# EAGLE design test_eyes (EAGLE 9.6.0)
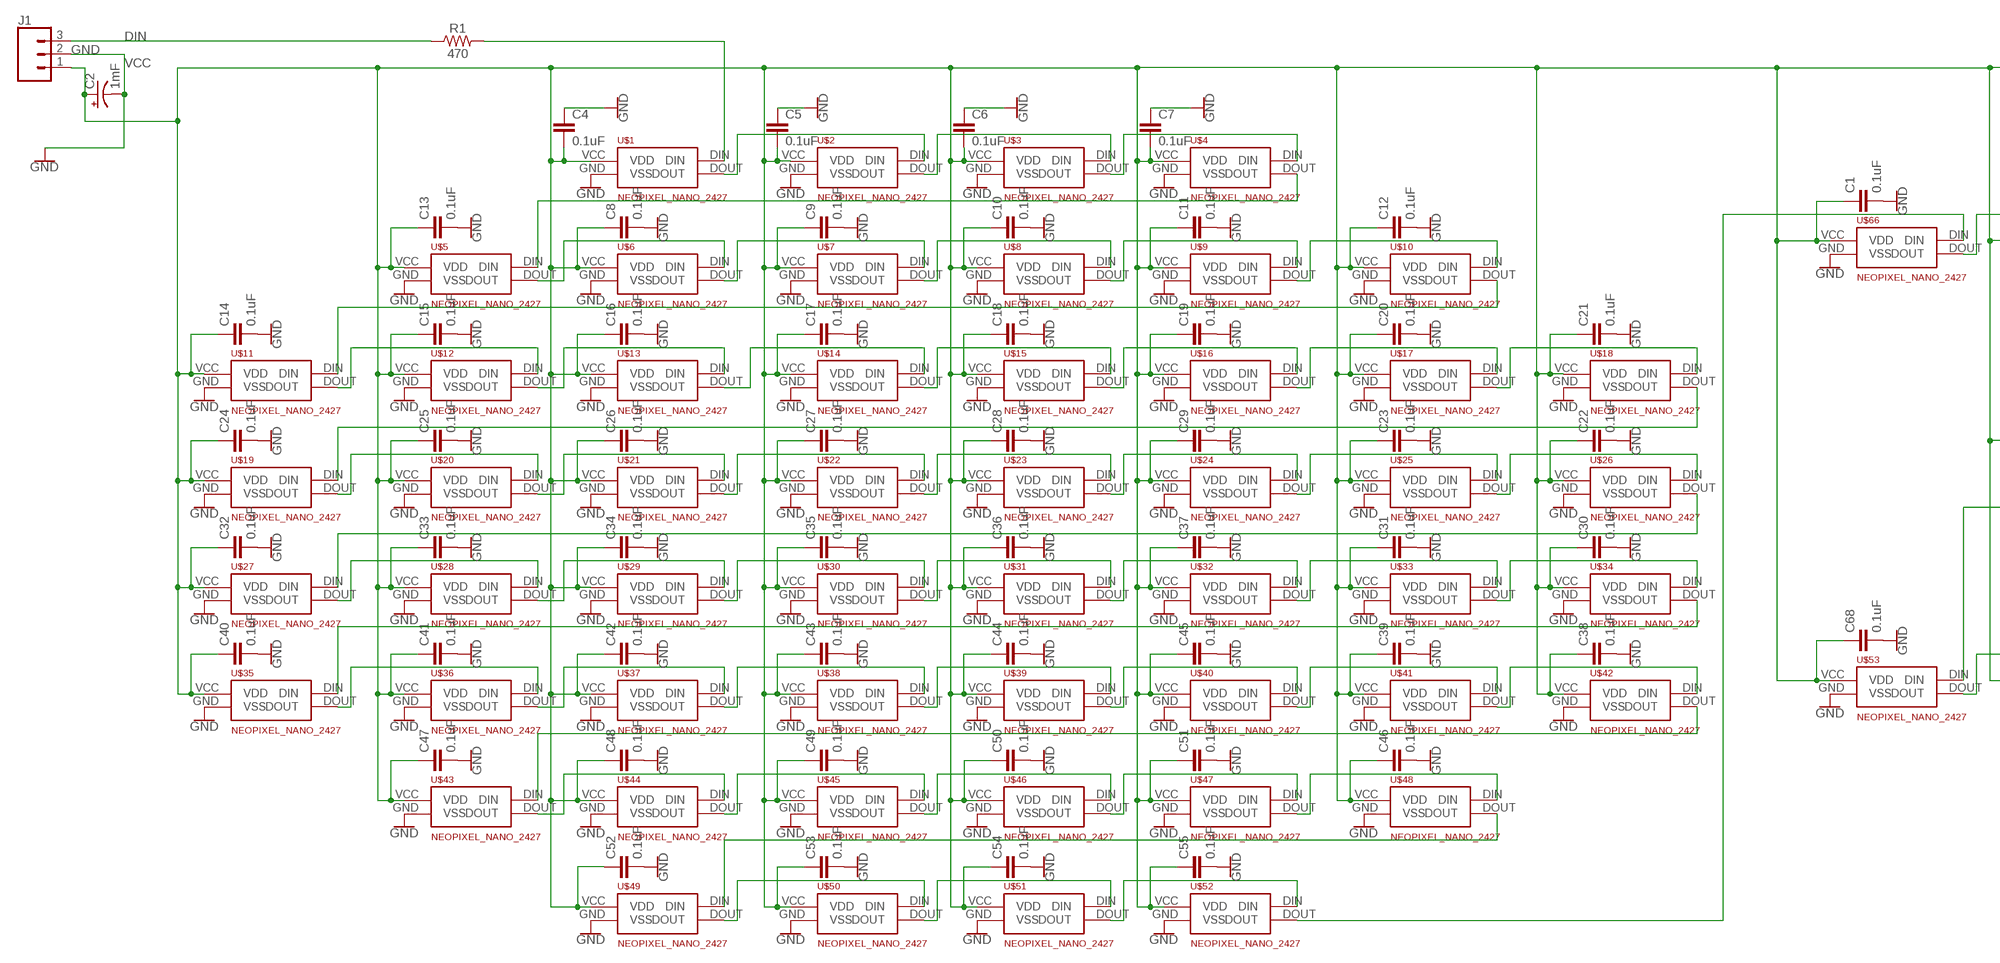
[diagram p0: schematic, sheet 1, part 1 of 3]
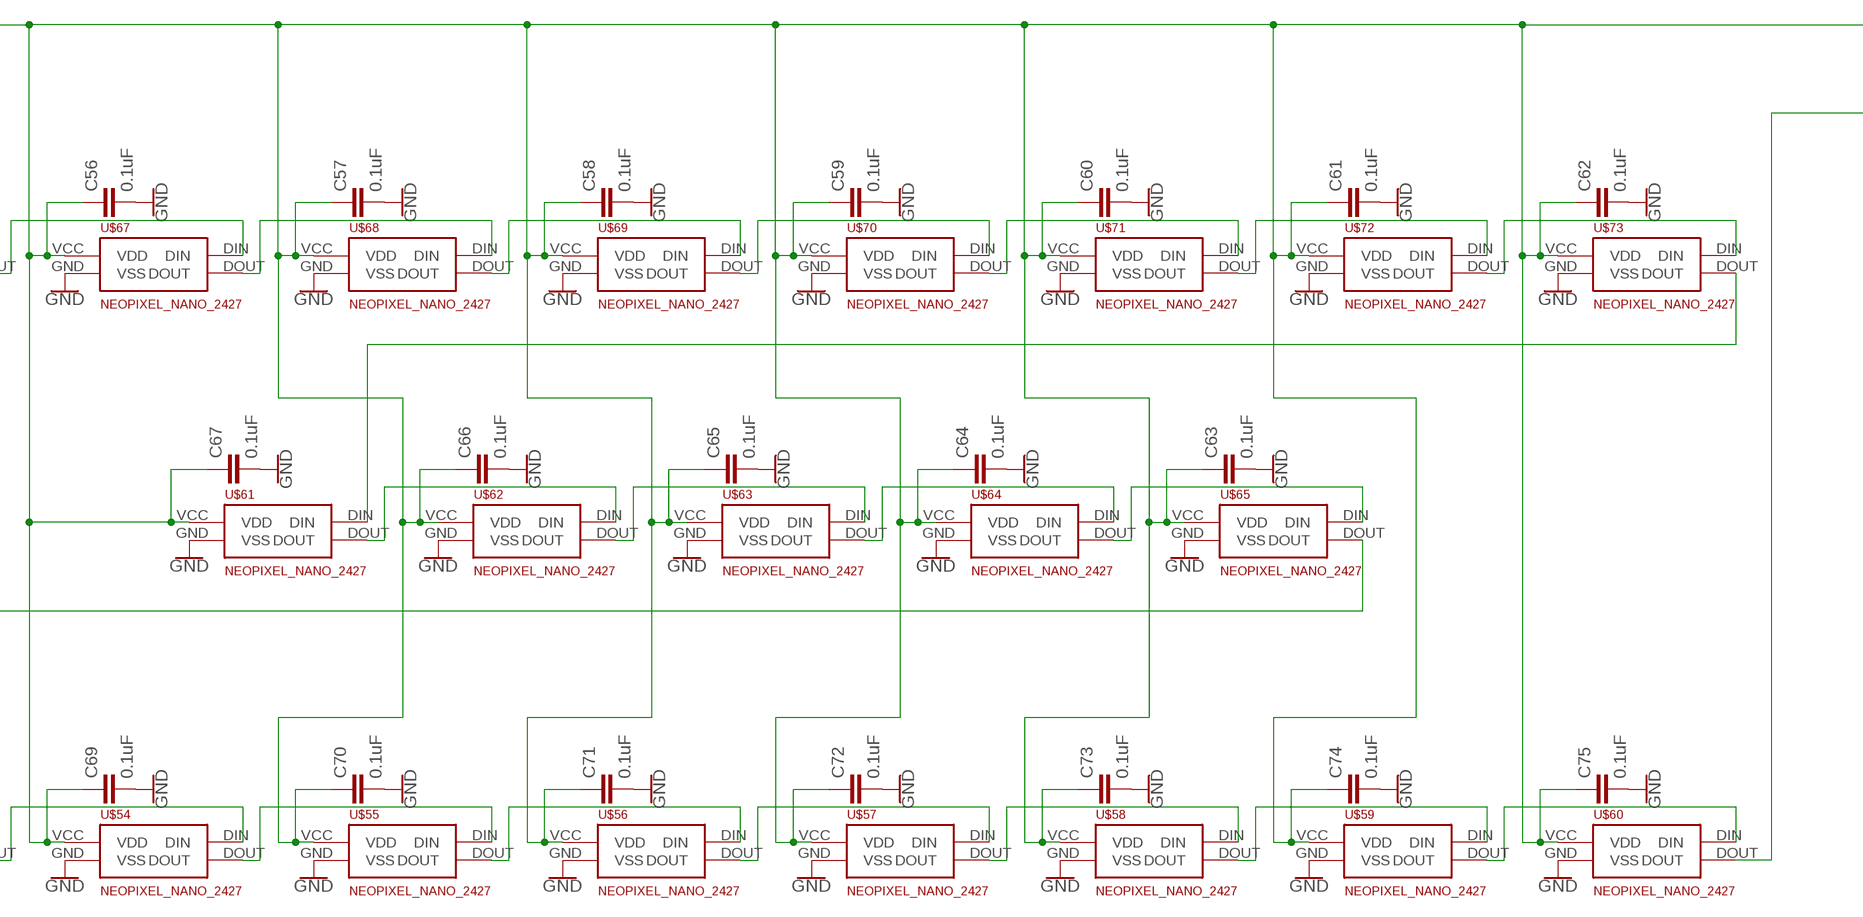
[diagram p1: schematic, sheet 1, part 2 of 3]
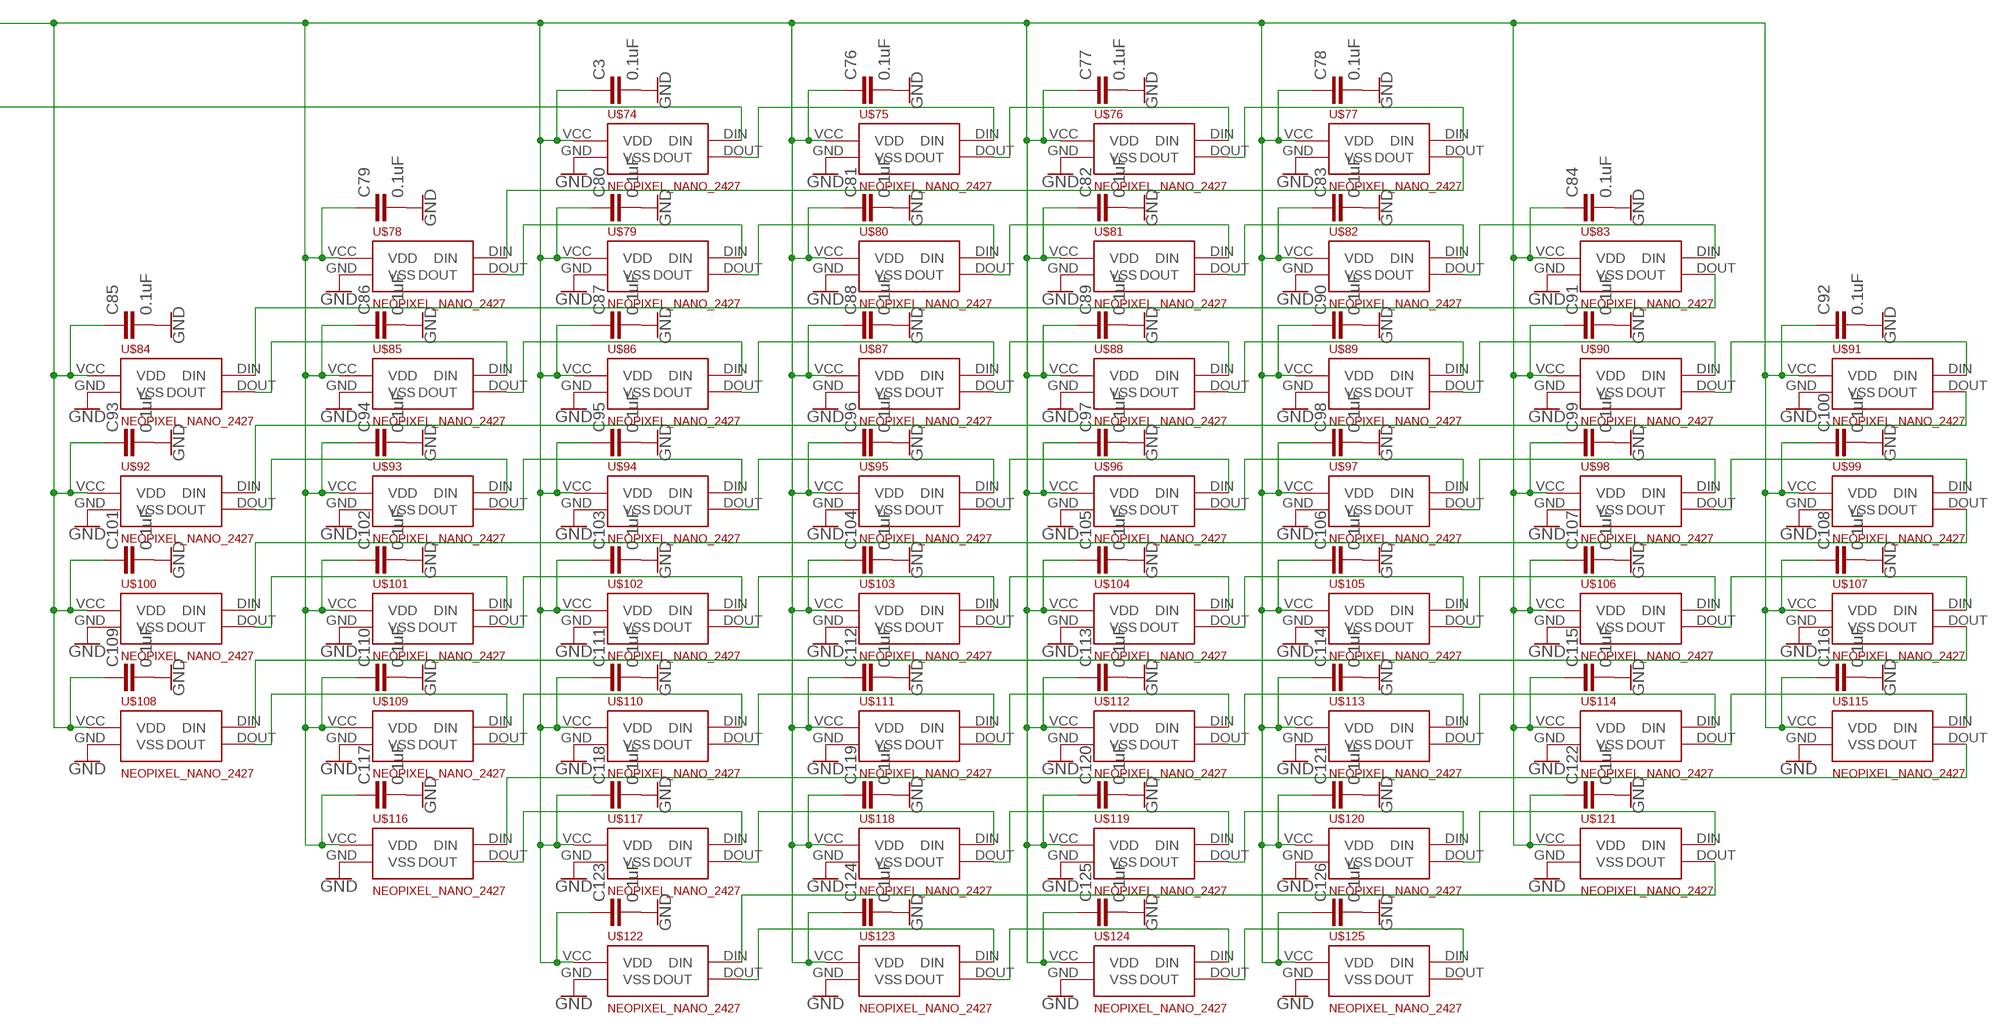
[diagram p2: schematic, sheet 1, part 3 of 3]

## Parts
C1  0.1uF  0.1UF-0402-16V-10%  [0402]
C2  1mF  1000UF-RADIAL-5MM-25V-20%  [CPOL-RADIAL-5MM-10MM]
C3  0.1uF  0.1UF-0402-16V-10%  [0402]
C4  0.1uF  0.1UF-0402-16V-10%  [0402]
C5  0.1uF  0.1UF-0402-16V-10%  [0402]
C6  0.1uF  0.1UF-0402-16V-10%  [0402]
C7  0.1uF  0.1UF-0402-16V-10%  [0402]
C8  0.1uF  0.1UF-0402-16V-10%  [0402]
C9  0.1uF  0.1UF-0402-16V-10%  [0402]
C10  0.1uF  0.1UF-0402-16V-10%  [0402]
C11  0.1uF  0.1UF-0402-16V-10%  [0402]
C12  0.1uF  0.1UF-0402-16V-10%  [0402]
C13  0.1uF  0.1UF-0402-16V-10%  [0402]
C14  0.1uF  0.1UF-0402-16V-10%  [0402]
C15  0.1uF  0.1UF-0402-16V-10%  [0402]
C16  0.1uF  0.1UF-0402-16V-10%  [0402]
C17  0.1uF  0.1UF-0402-16V-10%  [0402]
C18  0.1uF  0.1UF-0402-16V-10%  [0402]
C19  0.1uF  0.1UF-0402-16V-10%  [0402]
C20  0.1uF  0.1UF-0402-16V-10%  [0402]
C21  0.1uF  0.1UF-0402-16V-10%  [0402]
C22  0.1uF  0.1UF-0402-16V-10%  [0402]
C23  0.1uF  0.1UF-0402-16V-10%  [0402]
C24  0.1uF  0.1UF-0402-16V-10%  [0402]
C25  0.1uF  0.1UF-0402-16V-10%  [0402]
C26  0.1uF  0.1UF-0402-16V-10%  [0402]
C27  0.1uF  0.1UF-0402-16V-10%  [0402]
C28  0.1uF  0.1UF-0402-16V-10%  [0402]
C29  0.1uF  0.1UF-0402-16V-10%  [0402]
C30  0.1uF  0.1UF-0402-16V-10%  [0402]
C31  0.1uF  0.1UF-0402-16V-10%  [0402]
C32  0.1uF  0.1UF-0402-16V-10%  [0402]
C33  0.1uF  0.1UF-0402-16V-10%  [0402]
C34  0.1uF  0.1UF-0402-16V-10%  [0402]
C35  0.1uF  0.1UF-0402-16V-10%  [0402]
C36  0.1uF  0.1UF-0402-16V-10%  [0402]
C37  0.1uF  0.1UF-0402-16V-10%  [0402]
C38  0.1uF  0.1UF-0402-16V-10%  [0402]
C39  0.1uF  0.1UF-0402-16V-10%  [0402]
C40  0.1uF  0.1UF-0402-16V-10%  [0402]
C41  0.1uF  0.1UF-0402-16V-10%  [0402]
C42  0.1uF  0.1UF-0402-16V-10%  [0402]
C43  0.1uF  0.1UF-0402-16V-10%  [0402]
C44  0.1uF  0.1UF-0402-16V-10%  [0402]
C45  0.1uF  0.1UF-0402-16V-10%  [0402]
C46  0.1uF  0.1UF-0402-16V-10%  [0402]
C47  0.1uF  0.1UF-0402-16V-10%  [0402]
C48  0.1uF  0.1UF-0402-16V-10%  [0402]
C49  0.1uF  0.1UF-0402-16V-10%  [0402]
C50  0.1uF  0.1UF-0402-16V-10%  [0402]
C51  0.1uF  0.1UF-0402-16V-10%  [0402]
C52  0.1uF  0.1UF-0402-16V-10%  [0402]
C53  0.1uF  0.1UF-0402-16V-10%  [0402]
C54  0.1uF  0.1UF-0402-16V-10%  [0402]
C55  0.1uF  0.1UF-0402-16V-10%  [0402]
C56  0.1uF  0.1UF-0402-16V-10%  [0402]
C57  0.1uF  0.1UF-0402-16V-10%  [0402]
C58  0.1uF  0.1UF-0402-16V-10%  [0402]
C59  0.1uF  0.1UF-0402-16V-10%  [0402]
C60  0.1uF  0.1UF-0402-16V-10%  [0402]
C61  0.1uF  0.1UF-0402-16V-10%  [0402]
C62  0.1uF  0.1UF-0402-16V-10%  [0402]
C63  0.1uF  0.1UF-0402-16V-10%  [0402]
C64  0.1uF  0.1UF-0402-16V-10%  [0402]
C65  0.1uF  0.1UF-0402-16V-10%  [0402]
C66  0.1uF  0.1UF-0402-16V-10%  [0402]
C67  0.1uF  0.1UF-0402-16V-10%  [0402]
C68  0.1uF  0.1UF-0402-16V-10%  [0402]
C69  0.1uF  0.1UF-0402-16V-10%  [0402]
C70  0.1uF  0.1UF-0402-16V-10%  [0402]
C71  0.1uF  0.1UF-0402-16V-10%  [0402]
C72  0.1uF  0.1UF-0402-16V-10%  [0402]
C73  0.1uF  0.1UF-0402-16V-10%  [0402]
C74  0.1uF  0.1UF-0402-16V-10%  [0402]
C75  0.1uF  0.1UF-0402-16V-10%  [0402]
C76  0.1uF  0.1UF-0402-16V-10%  [0402]
C77  0.1uF  0.1UF-0402-16V-10%  [0402]
C78  0.1uF  0.1UF-0402-16V-10%  [0402]
C79  0.1uF  0.1UF-0402-16V-10%  [0402]
C80  0.1uF  0.1UF-0402-16V-10%  [0402]
C81  0.1uF  0.1UF-0402-16V-10%  [0402]
C82  0.1uF  0.1UF-0402-16V-10%  [0402]
C83  0.1uF  0.1UF-0402-16V-10%  [0402]
C84  0.1uF  0.1UF-0402-16V-10%  [0402]
C85  0.1uF  0.1UF-0402-16V-10%  [0402]
C86  0.1uF  0.1UF-0402-16V-10%  [0402]
C87  0.1uF  0.1UF-0402-16V-10%  [0402]
C88  0.1uF  0.1UF-0402-16V-10%  [0402]
C89  0.1uF  0.1UF-0402-16V-10%  [0402]
C90  0.1uF  0.1UF-0402-16V-10%  [0402]
C91  0.1uF  0.1UF-0402-16V-10%  [0402]
C92  0.1uF  0.1UF-0402-16V-10%  [0402]
C93  0.1uF  0.1UF-0402-16V-10%  [0402]
C94  0.1uF  0.1UF-0402-16V-10%  [0402]
C95  0.1uF  0.1UF-0402-16V-10%  [0402]
C96  0.1uF  0.1UF-0402-16V-10%  [0402]
C97  0.1uF  0.1UF-0402-16V-10%  [0402]
C98  0.1uF  0.1UF-0402-16V-10%  [0402]
C99  0.1uF  0.1UF-0402-16V-10%  [0402]
C100  0.1uF  0.1UF-0402-16V-10%  [0402]
C101  0.1uF  0.1UF-0402-16V-10%  [0402]
C102  0.1uF  0.1UF-0402-16V-10%  [0402]
C103  0.1uF  0.1UF-0402-16V-10%  [0402]
C104  0.1uF  0.1UF-0402-16V-10%  [0402]
C105  0.1uF  0.1UF-0402-16V-10%  [0402]
C106  0.1uF  0.1UF-0402-16V-10%  [0402]
C107  0.1uF  0.1UF-0402-16V-10%  [0402]
C108  0.1uF  0.1UF-0402-16V-10%  [0402]
C109  0.1uF  0.1UF-0402-16V-10%  [0402]
C110  0.1uF  0.1UF-0402-16V-10%  [0402]
C111  0.1uF  0.1UF-0402-16V-10%  [0402]
C112  0.1uF  0.1UF-0402-16V-10%  [0402]
C113  0.1uF  0.1UF-0402-16V-10%  [0402]
C114  0.1uF  0.1UF-0402-16V-10%  [0402]
C115  0.1uF  0.1UF-0402-16V-10%  [0402]
C116  0.1uF  0.1UF-0402-16V-10%  [0402]
C117  0.1uF  0.1UF-0402-16V-10%  [0402]
C118  0.1uF  0.1UF-0402-16V-10%  [0402]
C119  0.1uF  0.1UF-0402-16V-10%  [0402]
C120  0.1uF  0.1UF-0402-16V-10%  [0402]
C121  0.1uF  0.1UF-0402-16V-10%  [0402]
C122  0.1uF  0.1UF-0402-16V-10%  [0402]
C123  0.1uF  0.1UF-0402-16V-10%  [0402]
C124  0.1uF  0.1UF-0402-16V-10%  [0402]
C125  0.1uF  0.1UF-0402-16V-10%  [0402]
C126  0.1uF  0.1UF-0402-16V-10%  [0402]
J1  CONN_03JST-PTH-VERT  [JST-3-PTH-VERT]
R1  470  470OHM-0603-1/10W-1%  [0603]
U$1  NEOPIXEL_NANO_2427  [SK6805-2427]
U$2  NEOPIXEL_NANO_2427  [SK6805-2427]
U$3  NEOPIXEL_NANO_2427  [SK6805-2427]
U$4  NEOPIXEL_NANO_2427  [SK6805-2427]
U$5  NEOPIXEL_NANO_2427  [SK6805-2427]
U$6  NEOPIXEL_NANO_2427  [SK6805-2427]
U$7  NEOPIXEL_NANO_2427  [SK6805-2427]
U$8  NEOPIXEL_NANO_2427  [SK6805-2427]
U$9  NEOPIXEL_NANO_2427  [SK6805-2427]
U$10  NEOPIXEL_NANO_2427  [SK6805-2427]
U$11  NEOPIXEL_NANO_2427  [SK6805-2427]
U$12  NEOPIXEL_NANO_2427  [SK6805-2427]
U$13  NEOPIXEL_NANO_2427  [SK6805-2427]
U$14  NEOPIXEL_NANO_2427  [SK6805-2427]
U$15  NEOPIXEL_NANO_2427  [SK6805-2427]
U$16  NEOPIXEL_NANO_2427  [SK6805-2427]
U$17  NEOPIXEL_NANO_2427  [SK6805-2427]
U$18  NEOPIXEL_NANO_2427  [SK6805-2427]
U$19  NEOPIXEL_NANO_2427  [SK6805-2427]
U$20  NEOPIXEL_NANO_2427  [SK6805-2427]
U$21  NEOPIXEL_NANO_2427  [SK6805-2427]
U$22  NEOPIXEL_NANO_2427  [SK6805-2427]
U$23  NEOPIXEL_NANO_2427  [SK6805-2427]
U$24  NEOPIXEL_NANO_2427  [SK6805-2427]
U$25  NEOPIXEL_NANO_2427  [SK6805-2427]
U$26  NEOPIXEL_NANO_2427  [SK6805-2427]
U$27  NEOPIXEL_NANO_2427  [SK6805-2427]
U$28  NEOPIXEL_NANO_2427  [SK6805-2427]
U$29  NEOPIXEL_NANO_2427  [SK6805-2427]
U$30  NEOPIXEL_NANO_2427  [SK6805-2427]
U$31  NEOPIXEL_NANO_2427  [SK6805-2427]
U$32  NEOPIXEL_NANO_2427  [SK6805-2427]
U$33  NEOPIXEL_NANO_2427  [SK6805-2427]
U$34  NEOPIXEL_NANO_2427  [SK6805-2427]
U$35  NEOPIXEL_NANO_2427  [SK6805-2427]
U$36  NEOPIXEL_NANO_2427  [SK6805-2427]
U$37  NEOPIXEL_NANO_2427  [SK6805-2427]
U$38  NEOPIXEL_NANO_2427  [SK6805-2427]
U$39  NEOPIXEL_NANO_2427  [SK6805-2427]
U$40  NEOPIXEL_NANO_2427  [SK6805-2427]
U$41  NEOPIXEL_NANO_2427  [SK6805-2427]
U$42  NEOPIXEL_NANO_2427  [SK6805-2427]
U$43  NEOPIXEL_NANO_2427  [SK6805-2427]
U$44  NEOPIXEL_NANO_2427  [SK6805-2427]
U$45  NEOPIXEL_NANO_2427  [SK6805-2427]
U$46  NEOPIXEL_NANO_2427  [SK6805-2427]
U$47  NEOPIXEL_NANO_2427  [SK6805-2427]
U$48  NEOPIXEL_NANO_2427  [SK6805-2427]
U$49  NEOPIXEL_NANO_2427  [SK6805-2427]
U$50  NEOPIXEL_NANO_2427  [SK6805-2427]
U$51  NEOPIXEL_NANO_2427  [SK6805-2427]
U$52  NEOPIXEL_NANO_2427  [SK6805-2427]
U$53  NEOPIXEL_NANO_2427  [SK6805-2427]
U$54  NEOPIXEL_NANO_2427  [SK6805-2427]
U$55  NEOPIXEL_NANO_2427  [SK6805-2427]
U$56  NEOPIXEL_NANO_2427  [SK6805-2427]
U$57  NEOPIXEL_NANO_2427  [SK6805-2427]
U$58  NEOPIXEL_NANO_2427  [SK6805-2427]
U$59  NEOPIXEL_NANO_2427  [SK6805-2427]
U$60  NEOPIXEL_NANO_2427  [SK6805-2427]
U$61  NEOPIXEL_NANO_2427  [SK6805-2427]
U$62  NEOPIXEL_NANO_2427  [SK6805-2427]
U$63  NEOPIXEL_NANO_2427  [SK6805-2427]
U$64  NEOPIXEL_NANO_2427  [SK6805-2427]
U$65  NEOPIXEL_NANO_2427  [SK6805-2427]
U$66  NEOPIXEL_NANO_2427  [SK6805-2427]
U$67  NEOPIXEL_NANO_2427  [SK6805-2427]
U$68  NEOPIXEL_NANO_2427  [SK6805-2427]
U$69  NEOPIXEL_NANO_2427  [SK6805-2427]
U$70  NEOPIXEL_NANO_2427  [SK6805-2427]
U$71  NEOPIXEL_NANO_2427  [SK6805-2427]
U$72  NEOPIXEL_NANO_2427  [SK6805-2427]
U$73  NEOPIXEL_NANO_2427  [SK6805-2427]
U$74  NEOPIXEL_NANO_2427  [SK6805-2427]
U$75  NEOPIXEL_NANO_2427  [SK6805-2427]
U$76  NEOPIXEL_NANO_2427  [SK6805-2427]
U$77  NEOPIXEL_NANO_2427  [SK6805-2427]
U$78  NEOPIXEL_NANO_2427  [SK6805-2427]
U$79  NEOPIXEL_NANO_2427  [SK6805-2427]
U$80  NEOPIXEL_NANO_2427  [SK6805-2427]
U$81  NEOPIXEL_NANO_2427  [SK6805-2427]
U$82  NEOPIXEL_NANO_2427  [SK6805-2427]
U$83  NEOPIXEL_NANO_2427  [SK6805-2427]
U$84  NEOPIXEL_NANO_2427  [SK6805-2427]
U$85  NEOPIXEL_NANO_2427  [SK6805-2427]
U$86  NEOPIXEL_NANO_2427  [SK6805-2427]
U$87  NEOPIXEL_NANO_2427  [SK6805-2427]
U$88  NEOPIXEL_NANO_2427  [SK6805-2427]
U$89  NEOPIXEL_NANO_2427  [SK6805-2427]
U$90  NEOPIXEL_NANO_2427  [SK6805-2427]
U$91  NEOPIXEL_NANO_2427  [SK6805-2427]
U$92  NEOPIXEL_NANO_2427  [SK6805-2427]
U$93  NEOPIXEL_NANO_2427  [SK6805-2427]
U$94  NEOPIXEL_NANO_2427  [SK6805-2427]
U$95  NEOPIXEL_NANO_2427  [SK6805-2427]
U$96  NEOPIXEL_NANO_2427  [SK6805-2427]
U$97  NEOPIXEL_NANO_2427  [SK6805-2427]
U$98  NEOPIXEL_NANO_2427  [SK6805-2427]
U$99  NEOPIXEL_NANO_2427  [SK6805-2427]
U$100  NEOPIXEL_NANO_2427  [SK6805-2427]
U$101  NEOPIXEL_NANO_2427  [SK6805-2427]
U$102  NEOPIXEL_NANO_2427  [SK6805-2427]
U$103  NEOPIXEL_NANO_2427  [SK6805-2427]
U$104  NEOPIXEL_NANO_2427  [SK6805-2427]
U$105  NEOPIXEL_NANO_2427  [SK6805-2427]
U$106  NEOPIXEL_NANO_2427  [SK6805-2427]
U$107  NEOPIXEL_NANO_2427  [SK6805-2427]
U$108  NEOPIXEL_NANO_2427  [SK6805-2427]
U$109  NEOPIXEL_NANO_2427  [SK6805-2427]
U$110  NEOPIXEL_NANO_2427  [SK6805-2427]
U$111  NEOPIXEL_NANO_2427  [SK6805-2427]
U$112  NEOPIXEL_NANO_2427  [SK6805-2427]
U$113  NEOPIXEL_NANO_2427  [SK6805-2427]
U$114  NEOPIXEL_NANO_2427  [SK6805-2427]
U$115  NEOPIXEL_NANO_2427  [SK6805-2427]
U$116  NEOPIXEL_NANO_2427  [SK6805-2427]
U$117  NEOPIXEL_NANO_2427  [SK6805-2427]
U$118  NEOPIXEL_NANO_2427  [SK6805-2427]
U$119  NEOPIXEL_NANO_2427  [SK6805-2427]
U$120  NEOPIXEL_NANO_2427  [SK6805-2427]
U$121  NEOPIXEL_NANO_2427  [SK6805-2427]
U$122  NEOPIXEL_NANO_2427  [SK6805-2427]
U$123  NEOPIXEL_NANO_2427  [SK6805-2427]
U$124  NEOPIXEL_NANO_2427  [SK6805-2427]
U$125  NEOPIXEL_NANO_2427  [SK6805-2427]

## Nets
DIN: J1.3 R1.1
GND: C1.2 C2.- C3.2 C4.1 C5.1 C6.1 C7.1 C8.2 C9.2 C10.2 C11.2 C12.2 C13.2 C14.2 C15.2 C16.2 C17.2 C18.2 C19.2 C20.2 C21.2 C22.2 C23.2 C24.2 C25.2 C26.2 C27.2 C28.2 C29.2 C30.2 C31.2 C32.2 C33.2 C34.2 C35.2 C36.2 C37.2 C38.2 C39.2 C40.2 C41.2 C42.2 C43.2 C44.2 C45.2 C46.2 C47.2 C48.2 C49.2 C50.2 C51.2 C52.2 C53.2 C54.2 C55.2 C56.2 C57.2 C58.2 C59.2 C60.2 C61.2 C62.2 C63.2 C64.2 C65.2 C66.2 C67.2 C68.2 C69.2 C70.2 C71.2 C72.2 C73.2 C74.2 C75.2 C76.2 C77.2 C78.2 C79.2 C80.2 C81.2 C82.2 C83.2 C84.2 C85.2 C86.2 C87.2 C88.2 C89.2 C90.2 C91.2 C92.2 C93.2 C94.2 C95.2 C96.2 C97.2 C98.2 C99.2 C100.2 C101.2 C102.2 C103.2 C104.2 C105.2 C106.2 C107.2 C108.2 C109.2 C110.2 C111.2 C112.2 C113.2 C114.2 C115.2 C116.2 C117.2 C118.2 C119.2 C120.2 C121.2 C122.2 C123.2 C124.2 C125.2 C126.2 J1.2 U$1.GND(VSS) U$2.GND(VSS) U$3.GND(VSS) U$4.GND(VSS) U$5.GND(VSS) U$6.GND(VSS) U$7.GND(VSS) U$8.GND(VSS) U$9.GND(VSS) U$10.GND(VSS) U$11.GND(VSS) U$12.GND(VSS) U$13.GND(VSS) U$14.GND(VSS) U$15.GND(VSS) U$16.GND(VSS) U$17.GND(VSS) U$18.GND(VSS) U$19.GND(VSS) U$20.GND(VSS) U$21.GND(VSS) U$22.GND(VSS) U$23.GND(VSS) U$24.GND(VSS) U$25.GND(VSS) U$26.GND(VSS) U$27.GND(VSS) U$28.GND(VSS) U$29.GND(VSS) U$30.GND(VSS) U$31.GND(VSS) U$32.GND(VSS) U$33.GND(VSS) U$34.GND(VSS) U$35.GND(VSS) U$36.GND(VSS) U$37.GND(VSS) U$38.GND(VSS) U$39.GND(VSS) U$40.GND(VSS) U$41.GND(VSS) U$42.GND(VSS) U$43.GND(VSS) U$44.GND(VSS) U$45.GND(VSS) U$46.GND(VSS) U$47.GND(VSS) U$48.GND(VSS) U$49.GND(VSS) U$50.GND(VSS) U$51.GND(VSS) U$52.GND(VSS) U$53.GND(VSS) U$54.GND(VSS) U$55.GND(VSS) U$56.GND(VSS) U$57.GND(VSS) U$58.GND(VSS) U$59.GND(VSS) U$60.GND(VSS) U$61.GND(VSS) U$62.GND(VSS) U$63.GND(VSS) U$64.GND(VSS) U$65.GND(VSS) U$66.GND(VSS) U$67.GND(VSS) U$68.GND(VSS) U$69.GND(VSS) U$70.GND(VSS) U$71.GND(VSS) U$72.GND(VSS) U$73.GND(VSS) U$74.GND(VSS) U$75.GND(VSS) U$76.GND(VSS) U$77.GND(VSS) U$78.GND(VSS) U$79.GND(VSS) U$80.GND(VSS) U$81.GND(VSS) U$82.GND(VSS) U$83.GND(VSS) U$84.GND(VSS) U$85.GND(VSS) U$86.GND(VSS) U$87.GND(VSS) U$88.GND(VSS) U$89.GND(VSS) U$90.GND(VSS) U$91.GND(VSS) U$92.GND(VSS) U$93.GND(VSS) U$94.GND(VSS) U$95.GND(VSS) U$96.GND(VSS) U$97.GND(VSS) U$98.GND(VSS) U$99.GND(VSS) U$100.GND(VSS) U$101.GND(VSS) U$102.GND(VSS) U$103.GND(VSS) U$104.GND(VSS) U$105.GND(VSS) U$106.GND(VSS) U$107.GND(VSS) U$108.GND(VSS) U$109.GND(VSS) U$110.GND(VSS) U$111.GND(VSS) U$112.GND(VSS) U$113.GND(VSS) U$114.GND(VSS) U$115.GND(VSS) U$116.GND(VSS) U$117.GND(VSS) U$118.GND(VSS) U$119.GND(VSS) U$120.GND(VSS) U$121.GND(VSS) U$122.GND(VSS) U$123.GND(VSS) U$124.GND(VSS) U$125.GND(VSS)
N$1: U$2.DOUT U$3.DIN
N$2: U$3.DOUT U$4.DIN
N$3: R1.2 U$1.DIN
N$4: U$1.DOUT U$2.DIN
N$5: U$4.DOUT U$5.DIN
N$6: U$5.DOUT U$6.DIN
N$7: U$6.DOUT U$7.DIN
N$8: U$7.DOUT U$8.DIN
N$9: U$8.DOUT U$9.DIN
N$10: U$9.DOUT U$10.DIN
N$11: U$10.DOUT U$11.DIN
N$12: U$11.DOUT U$12.DIN
N$13: U$12.DOUT U$13.DIN
N$14: U$13.DOUT U$14.DIN
N$15: U$14.DOUT U$15.DIN
N$16: U$15.DOUT U$16.DIN
N$17: U$16.DOUT U$17.DIN
N$18: U$17.DOUT U$18.DIN
N$19: U$18.DOUT U$19.DIN
N$20: U$19.DOUT U$20.DIN
N$21: U$20.DOUT U$21.DIN
N$22: U$21.DOUT U$22.DIN
N$23: U$22.DOUT U$23.DIN
N$24: U$23.DOUT U$24.DIN
N$25: U$24.DOUT U$25.DIN
N$26: U$25.DOUT U$26.DIN
N$27: U$26.DOUT U$27.DIN
N$28: U$27.DOUT U$28.DIN
N$29: U$28.DOUT U$29.DIN
N$30: U$29.DOUT U$30.DIN
N$31: U$30.DOUT U$31.DIN
N$32: U$31.DOUT U$32.DIN
N$33: U$32.DOUT U$33.DIN
N$34: U$33.DOUT U$34.DIN
N$35: U$34.DOUT U$35.DIN
N$36: U$35.DOUT U$36.DIN
N$37: U$36.DOUT U$37.DIN
N$38: U$37.DOUT U$38.DIN
N$39: U$38.DOUT U$39.DIN
N$40: U$39.DOUT U$40.DIN
N$41: U$40.DOUT U$41.DIN
N$42: U$41.DOUT U$42.DIN
N$43: U$42.DOUT U$43.DIN
N$44: U$43.DOUT U$44.DIN
N$45: U$44.DOUT U$45.DIN
N$46: U$45.DOUT U$46.DIN
N$47: U$46.DOUT U$47.DIN
N$48: U$47.DOUT U$48.DIN
N$49: U$48.DOUT U$49.DIN
N$50: U$49.DOUT U$50.DIN
N$51: U$50.DOUT U$51.DIN
N$52: U$51.DOUT U$52.DIN
N$53: U$52.DOUT U$66.DIN
N$54: U$60.DOUT U$74.DIN
N$107: U$74.DOUT U$75.DIN
N$108: U$75.DOUT U$76.DIN
N$109: U$76.DOUT U$77.DIN
N$110: U$77.DOUT U$78.DIN
N$111: U$78.DOUT U$79.DIN
N$112: U$79.DOUT U$80.DIN
N$113: U$80.DOUT U$81.DIN
N$114: U$81.DOUT U$82.DIN
N$115: U$82.DOUT U$83.DIN
N$116: U$83.DOUT U$84.DIN
N$117: U$66.DOUT U$67.DIN
N$118: U$67.DOUT U$68.DIN
N$119: U$68.DOUT U$69.DIN
N$120: U$69.DOUT U$70.DIN
N$121: U$70.DOUT U$71.DIN
N$122: U$71.DOUT U$72.DIN
N$123: U$72.DOUT U$73.DIN
N$124: U$84.DOUT U$85.DIN
N$125: U$85.DOUT U$86.DIN
N$126: U$86.DOUT U$87.DIN
N$127: U$87.DOUT U$88.DIN
N$128: U$88.DOUT U$89.DIN
N$129: U$89.DOUT U$90.DIN
N$130: U$91.DOUT U$92.DIN
N$131: U$92.DOUT U$93.DIN
N$132: U$93.DOUT U$94.DIN
N$133: U$94.DOUT U$95.DIN
N$134: U$95.DOUT U$96.DIN
N$135: U$61.DIN U$73.DOUT
N$136: U$61.DOUT U$62.DIN
N$137: U$96.DOUT U$97.DIN
N$138: U$62.DOUT U$63.DIN
N$139: U$63.DOUT U$64.DIN
N$140: U$64.DOUT U$65.DIN
N$141: U$53.DIN U$65.DOUT
N$142: U$53.DOUT U$54.DIN
N$143: U$54.DOUT U$55.DIN
N$144: U$55.DOUT U$56.DIN
N$145: U$56.DOUT U$57.DIN
N$146: U$57.DOUT U$58.DIN
N$147: U$58.DOUT U$59.DIN
N$148: U$59.DOUT U$60.DIN
N$149: U$97.DOUT U$98.DIN
N$150: U$98.DOUT U$99.DIN
N$151: U$99.DOUT U$100.DIN
N$152: U$100.DOUT U$101.DIN
N$153: U$101.DOUT U$102.DIN
N$154: U$102.DOUT U$103.DIN
N$155: U$103.DOUT U$104.DIN
N$156: U$104.DOUT U$105.DIN
N$157: U$105.DOUT U$106.DIN
N$158: U$106.DOUT U$107.DIN
N$159: U$107.DOUT U$108.DIN
N$160: U$108.DOUT U$109.DIN
N$161: U$109.DOUT U$110.DIN
N$162: U$110.DOUT U$111.DIN
N$163: U$111.DOUT U$112.DIN
N$164: U$112.DOUT U$113.DIN
N$165: U$113.DOUT U$114.DIN
N$166: U$114.DOUT U$115.DIN
N$167: U$115.DOUT U$116.DIN
N$168: U$116.DOUT U$117.DIN
N$169: U$117.DOUT U$118.DIN
N$170: U$118.DOUT U$119.DIN
N$171: U$119.DOUT U$120.DIN
N$172: U$120.DOUT U$121.DIN
N$173: U$121.DOUT U$122.DIN
N$174: U$122.DOUT U$123.DIN
N$175: U$123.DOUT U$124.DIN
N$176: U$124.DOUT U$125.DIN
N$177: U$90.DOUT U$91.DIN
VCC: C1.1 C2.+ C3.1 C4.2 C5.2 C6.2 C7.2 C8.1 C9.1 C10.1 C11.1 C12.1 C13.1 C14.1 C15.1 C16.1 C17.1 C18.1 C19.1 C20.1 C21.1 C22.1 C23.1 C24.1 C25.1 C26.1 C27.1 C28.1 C29.1 C30.1 C31.1 C32.1 C33.1 C34.1 C35.1 C36.1 C37.1 C38.1 C39.1 C40.1 C41.1 C42.1 C43.1 C44.1 C45.1 C46.1 C47.1 C48.1 C49.1 C50.1 C51.1 C52.1 C53.1 C54.1 C55.1 C56.1 C57.1 C58.1 C59.1 C60.1 C61.1 C62.1 C63.1 C64.1 C65.1 C66.1 C67.1 C68.1 C69.1 C70.1 C71.1 C72.1 C73.1 C74.1 C75.1 C76.1 C77.1 C78.1 C79.1 C80.1 C81.1 C82.1 C83.1 C84.1 C85.1 C86.1 C87.1 C88.1 C89.1 C90.1 C91.1 C92.1 C93.1 C94.1 C95.1 C96.1 C97.1 C98.1 C99.1 C100.1 C101.1 C102.1 C103.1 C104.1 C105.1 C106.1 C107.1 C108.1 C109.1 C110.1 C111.1 C112.1 C113.1 C114.1 C115.1 C116.1 C117.1 C118.1 C119.1 C120.1 C121.1 C122.1 C123.1 C124.1 C125.1 C126.1 J1.1 U$1.VCC(VDD) U$2.VCC(VDD) U$3.VCC(VDD) U$4.VCC(VDD) U$5.VCC(VDD) U$6.VCC(VDD) U$7.VCC(VDD) U$8.VCC(VDD) U$9.VCC(VDD) U$10.VCC(VDD) U$11.VCC(VDD) U$12.VCC(VDD) U$13.VCC(VDD) U$14.VCC(VDD) U$15.VCC(VDD) U$16.VCC(VDD) U$17.VCC(VDD) U$18.VCC(VDD) U$19.VCC(VDD) U$20.VCC(VDD) U$21.VCC(VDD) U$22.VCC(VDD) U$23.VCC(VDD) U$24.VCC(VDD) U$25.VCC(VDD) U$26.VCC(VDD) U$27.VCC(VDD) U$28.VCC(VDD) U$29.VCC(VDD) U$30.VCC(VDD) U$31.VCC(VDD) U$32.VCC(VDD) U$33.VCC(VDD) U$34.VCC(VDD) U$35.VCC(VDD) U$36.VCC(VDD) U$37.VCC(VDD) U$38.VCC(VDD) U$39.VCC(VDD) U$40.VCC(VDD) U$41.VCC(VDD) U$42.VCC(VDD) U$43.VCC(VDD) U$44.VCC(VDD) U$45.VCC(VDD) U$46.VCC(VDD) U$47.VCC(VDD) U$48.VCC(VDD) U$49.VCC(VDD) U$50.VCC(VDD) U$51.VCC(VDD) U$52.VCC(VDD) U$53.VCC(VDD) U$54.VCC(VDD) U$55.VCC(VDD) U$56.VCC(VDD) U$57.VCC(VDD) U$58.VCC(VDD) U$59.VCC(VDD) U$60.VCC(VDD) U$61.VCC(VDD) U$62.VCC(VDD) U$63.VCC(VDD) U$64.VCC(VDD) U$65.VCC(VDD) U$66.VCC(VDD) U$67.VCC(VDD) U$68.VCC(VDD) U$69.VCC(VDD) U$70.VCC(VDD) U$71.VCC(VDD) U$72.VCC(VDD) U$73.VCC(VDD) U$74.VCC(VDD) U$75.VCC(VDD) U$76.VCC(VDD) U$77.VCC(VDD) U$78.VCC(VDD) U$79.VCC(VDD) U$80.VCC(VDD) U$81.VCC(VDD) U$82.VCC(VDD) U$83.VCC(VDD) U$84.VCC(VDD) U$85.VCC(VDD) U$86.VCC(VDD) U$87.VCC(VDD) U$88.VCC(VDD) U$89.VCC(VDD) U$90.VCC(VDD) U$91.VCC(VDD) U$92.VCC(VDD) U$93.VCC(VDD) U$94.VCC(VDD) U$95.VCC(VDD) U$96.VCC(VDD) U$97.VCC(VDD) U$98.VCC(VDD) U$99.VCC(VDD) U$100.VCC(VDD) U$101.VCC(VDD) U$102.VCC(VDD) U$103.VCC(VDD) U$104.VCC(VDD) U$105.VCC(VDD) U$106.VCC(VDD) U$107.VCC(VDD) U$108.VCC(VDD) U$109.VCC(VDD) U$110.VCC(VDD) U$111.VCC(VDD) U$112.VCC(VDD) U$113.VCC(VDD) U$114.VCC(VDD) U$115.VCC(VDD) U$116.VCC(VDD) U$117.VCC(VDD) U$118.VCC(VDD) U$119.VCC(VDD) U$120.VCC(VDD) U$121.VCC(VDD) U$122.VCC(VDD) U$123.VCC(VDD) U$124.VCC(VDD) U$125.VCC(VDD)
Unconnected: U$125.DOUT

## Library data of the parts
C1 C3-C126 = SparkFun-Capacitors:0.1UF: 0.1µF ceramic capacitors A capacitor is a passive two-terminal electrical component used to store electrical energy temporarily in an electric field.; PROD_ID: CAP-12416
C2 = SparkFun-Capacitors:1000UF: 1,000µF/1mF ceramic capacitors A capacitor is a passive two-terminal electrical component used to store electrical energy temporarily in an electric field. CAP-08070; PROD_ID: CAP-09538
J1 = SparkFun-Connectors:CONN_03: Multi connection point. Often used as Generic Header-pin footprint for 0.1 inch spaced/style header connections On any of the 0.1 inch spaced packages, you can populate with these: Break Away Headers - Straight <https://www.sparkfun.com/products/116> (PRT-00116) Break Away Male Headers - Right Angle <https://www.sparkfun.com/products/553> (PRT-00553) Female Headers <https://www.sparkfun.com/products/115> (PRT-00115) Break Away Headers - Machine Pin <https://www.sparkfun.com/products/117> (PRT-00117) Break Away Female Headers - Swiss Machine Pin <https://www.sparkfun.com/products/743> (PRT-00743) Stackable Header - 3 Pin (Female, 0.1") <https://www.sparkfun.com/products/13875> (PRT-13875) For SCREWTERMINALS and SPRING TERMINALS visit here: Screw Terimnals on SparkFun.com <https://www.sparkfun.com/search/results?term=Screw+Terminals> (5mm/3.5mm/2.54mm spacing) This device is also useful as a general connection point to wire up your design to another part of your project. Our various solder wires solder well into these plated through hole pads. Hook-Up Wire - Assortment (Stranded, 22 AWG) <https://www.sparkfun.com/products/11375> (PRT-11375) Hook-Up Wire - Assortment (Solid Core, 22 AWG) <https://www.sparkfun.com/products/11367> (PRT-11367) View the entire wire category on our website here <https://www.sparkfun.com/categories/141> Special notes: Molex polarized connector foot print use with SKU : PRT-08232 with associated crimp pins and housings.; PROD_ID: CONN-13230
R1 = SparkFun-Resistors:470OHM: 470Ω resistor A resistor is a passive two-terminal electrical component that implements electrical resistance as a circuit element. Resistors act to reduce current flow, and, at the same time, act to lower voltage levels within circuits. - Wikipedia; PROD_ID: RES-07869
U$1-U$125 = NeoPixel Nano 2427:NEOPIXEL_NANO_2427

## Board
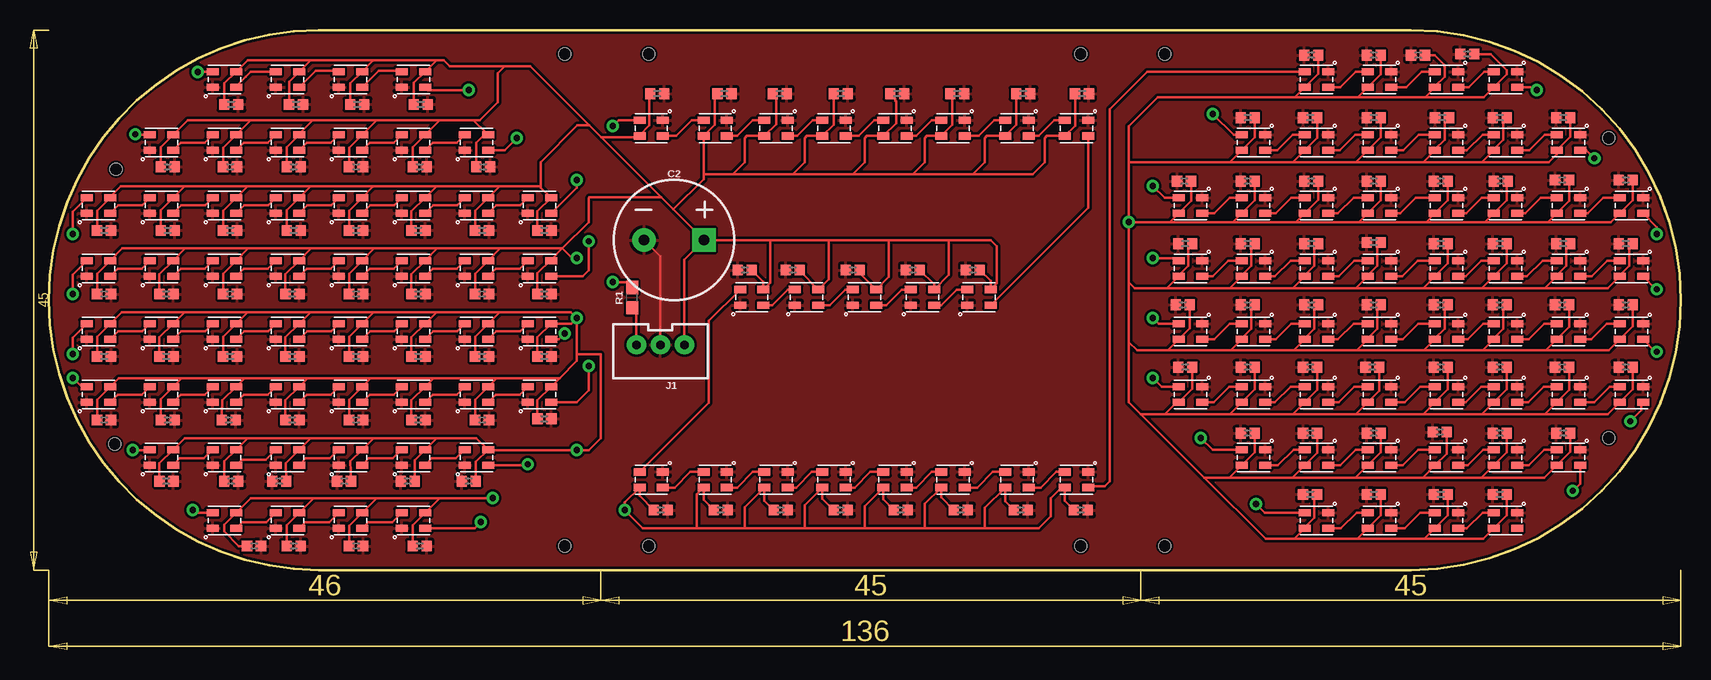
[diagram p3: board, top side]
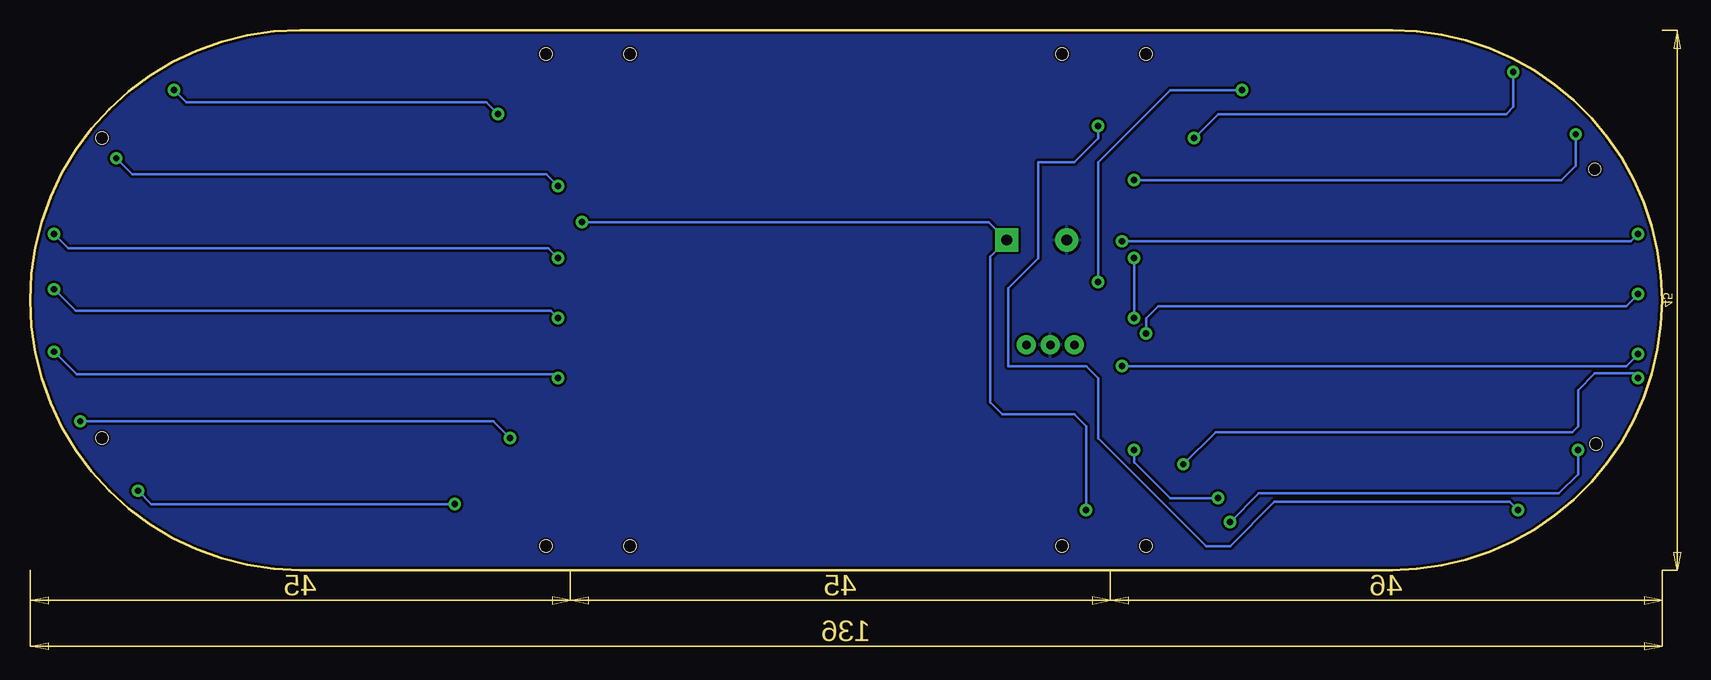
[diagram p4: board, bottom side, seen from below]

Size 137.57 x 51.65 mm. Coordinates in mm from the lower left corner, seen from the top.
Outline: 92.57,51.65 115.07,51.65 arc-180 115.07,6.65 24.07,6.65 arc-90 1.57,29.15 arc-90 24.07,51.65 92.57,51.65
Outline: 93.57,51.65 92.57,51.65
Copper layers (1*16): Top 0.035mm / dielectric 1.5mm / Bottom 0.035mm
Design rules "SparkFun": minimum track width 8mil, minimum drill 20mil, track to track 8mil, track to pad 8mil, pad to pad 8mil, via to via 8mil, smd to smd 8mil, copper to edge 8mil, drill to drill 8mil, minimum pad ring 12mil, minimum via ring 10mil, stop-mask expansion 4mil, vias tented up to drill 20mil, thermal gap 10mil
Holes 1 mm at 7.17,40.05 7.07,17.15 44.57,49.65 44.57,8.65 51.57,49.65 51.57,8.65 87.57,8.65 87.57,49.65 94.57,49.65 94.57,8.65 131.57,17.65 131.57,42.65

### Footprints (pad centres in the part's own frame; a part is rotated, then mirrored left to right if it is on the bottom)
0402 = smd 0.85 x 0.9: 1 -0.58,0; 2 0.58,0
CPOL-RADIAL-5MM-10MM = drill 0.9 pad 1.93 square: + 2.5,0 | drill 0.9 pad 1.93: - -2.5,0
JST-3-PTH-VERT = drill 0.7 pad 1.6: 1 -2,-0.55; 2 0,-0.55; 3 2,-0.55
0603 = smd 1.1 x 1: 1 -0.85,0; 2 0.85,0
SK6805-2427 = smd 1 x 0.6: DIN 0.375,1.85; DOUT 2.325,0.55; GND 2.325,1.85; VCC 0.375,0.55

### Placement (x,y rotation side)
C1  52.27,46.35 0 top
C2  53.67,34.15 0 top
C3  106.77,49.55 180 top
C4  32.57,45.45 180 top
C5  27.27,45.45 180 top
C6  22.17,45.45 180 top
C7  16.77,45.45 180 top
C8  32.47,40.25 0 top
C9  27.17,40.25 0 top
C10  21.97,40.25 0 top
C11  16.67,40.25 0 top
C12  11.47,40.25 0 top
C13  37.77,40.25 0 top
C14  42.87,34.95 0 top
C15  37.67,34.95 0 top
C16  32.37,34.95 0 top
C17  27.17,34.95 0 top
C18  21.97,34.95 0 top
C19  16.67,34.95 0 top
C20  11.47,34.95 0 top
C21  6.17,34.95 0 top
C22  6.17,29.65 0 top
C23  11.37,29.65 0 top
C24  42.87,29.65 0 top
C25  37.67,29.65 0 top
C26  32.37,29.65 0 top
C27  27.17,29.65 0 top
C28  21.87,29.65 0 top
C29  16.67,29.65 0 top
C30  6.17,24.45 0 top
C31  11.37,24.45 0 top
C32  42.87,24.45 0 top
C33  37.67,24.45 0 top
C34  32.37,24.45 0 top
C35  27.17,24.45 0 top
C36  21.87,24.45 0 top
C37  16.67,24.45 0 top
C38  6.17,19.15 0 top
C39  11.47,19.15 0 top
C40  42.87,19.25 0 top
C41  37.67,19.15 0 top
C42  32.37,19.15 0 top
C43  27.17,19.15 0 top
C44  21.87,19.15 0 top
C45  16.57,19.15 0 top
C46  11.37,14.05 0 top
C47  36.57,14.05 180 top
C48  31.47,14.05 180 top
C49  26.17,14.05 180 top
C50  20.77,14.05 180 top
C51  16.77,14.05 0 top
C52  32.47,8.65 0 top
C53  27.17,8.65 0 top
C54  21.97,8.65 0 top
C55  18.67,8.65 0 top
C56  57.87,46.35 0 top
C57  62.47,46.35 0 top
C58  67.57,46.35 0 top
C59  72.27,46.35 0 top
C60  77.27,46.35 0 top
C61  82.77,46.35 0 top
C62  87.67,46.35 0 top
C63  68.57,31.65 180 top
C64  63.57,31.65 180 top
C65  59.57,31.65 180 top
C66  73.57,31.65 180 top
C67  78.57,31.65 180 top
C68  52.57,11.65 0 top
C69  57.57,11.65 0 top
C70  62.57,11.65 0 top
C71  67.57,11.65 0 top
C72  72.57,11.65 0 top
C73  77.57,11.65 0 top
C74  82.57,11.65 0 top
C75  87.57,11.65 0 top
C76  111.97,49.55 180 top
C77  115.67,49.55 180 top
C78  119.77,49.65 180 top
C79  101.47,44.35 180 top
C80  106.67,44.35 180 top
C81  111.97,44.35 180 top
C82  117.67,44.35 180 top
C83  122.47,44.35 180 top
C84  127.77,44.35 180 top
C85  96.17,39.05 180 top
C86  101.47,39.05 180 top
C87  106.77,39.05 180 top
C88  111.97,39.05 180 top
C89  117.57,39.05 180 top
C90  122.57,39.05 180 top
C91  127.67,39.15 180 top
C92  132.97,39.15 180 top
C93  96.27,33.85 180 top
C94  101.47,33.85 180 top
C95  106.77,33.85 180 top
C96  111.97,33.95 180 top
C97  117.57,33.85 180 top
C98  122.47,33.85 180 top
C99  127.77,33.85 180 top
C100  132.97,33.85 180 top
C101  96.07,28.75 180 top
C102  101.47,28.75 180 top
C103  106.77,28.75 180 top
C104  111.97,28.75 180 top
C105  117.57,28.75 180 top
C106  122.47,28.75 180 top
C107  127.67,28.75 180 top
C108  132.97,28.75 180 top
C109  96.27,23.55 180 top
C110  101.47,23.55 180 top
C111  106.67,23.55 180 top
C112  111.87,23.55 180 top
C113  117.57,23.55 180 top
C114  122.47,23.55 180 top
C115  127.67,23.55 180 top
C116  132.97,23.55 180 top
C117  101.47,18.05 180 top
C118  106.67,18.05 180 top
C119  111.97,18.05 180 top
C120  117.47,18.15 180 top
C121  122.47,18.05 180 top
C122  127.77,18.05 180 top
C123  106.67,12.95 180 top
C124  111.97,12.95 180 top
C125  117.57,12.95 180 top
C126  122.47,12.95 180 top
J1  52.54,24.86 180 top
R1  50.17,29.35 90 top
U$1  33.3,48.73 180 top
U$2  28.05,48.73 180 top
U$3  22.8,48.73 180 top
U$4  17.54,48.73 180 top
U$5  38.55,43.48 180 top
U$6  33.3,43.48 180 top
U$7  28.05,43.48 180 top
U$8  22.8,43.48 180 top
U$9  17.54,43.48 180 top
U$10  12.29,43.48 180 top
U$11  43.8,38.23 180 top
U$12  38.55,38.23 180 top
U$13  33.3,38.23 180 top
U$14  28.05,38.23 180 top
U$15  22.8,38.23 180 top
U$16  17.54,38.23 180 top
U$17  12.29,38.23 180 top
U$18  7.04,38.23 180 top
U$19  43.8,32.98 180 top
U$20  38.55,32.98 180 top
U$21  33.3,32.98 180 top
U$22  28.05,32.98 180 top
U$23  22.8,32.98 180 top
U$24  17.54,32.98 180 top
U$25  12.29,32.98 180 top
U$26  7.04,32.98 180 top
U$27  43.8,27.72 180 top
U$28  38.55,27.72 180 top
U$29  33.3,27.72 180 top
U$30  28.05,27.72 180 top
U$31  22.8,27.72 180 top
U$32  17.54,27.72 180 top
U$33  12.29,27.72 180 top
U$34  7.04,27.72 180 top
U$35  43.8,22.47 180 top
U$36  38.55,22.47 180 top
U$37  33.3,22.47 180 top
U$38  28.05,22.47 180 top
U$39  22.8,22.47 180 top
U$40  17.54,22.47 180 top
U$41  12.29,22.47 180 top
U$42  7.04,22.47 180 top
U$43  38.55,17.22 180 top
U$44  33.3,17.22 180 top
U$45  28.05,17.22 180 top
U$46  22.8,17.22 180 top
U$47  17.54,17.22 180 top
U$48  12.29,17.22 180 top
U$49  33.3,11.97 180 top
U$50  28.05,11.97 180 top
U$51  22.8,11.97 180 top
U$52  17.54,11.97 180 top
U$53  50.42,12.97 0 top
U$54  55.75,12.97 0 top
U$55  60.83,12.97 0 top
U$56  65.66,12.97 0 top
U$57  70.74,12.97 0 top
U$58  75.56,12.97 0 top
U$59  80.9,12.97 0 top
U$60  85.85,12.97 0 top
U$61  80.42,30.57 180 top
U$62  75.72,30.57 180 top
U$63  70.9,30.57 180 top
U$64  66.07,30.57 180 top
U$65  61.5,30.57 180 top
U$66  50.42,42.27 0 top
U$67  55.75,42.27 0 top
U$68  60.83,42.27 0 top
U$69  65.66,42.27 0 top
U$70  70.74,42.27 0 top
U$71  75.56,42.27 0 top
U$72  80.9,42.27 0 top
U$73  85.85,42.27 0 top
U$74  105.84,46.32 0 top
U$75  111.09,46.32 0 top
U$76  116.7,46.32 0 top
U$77  121.59,46.32 0 top
U$78  100.59,41.07 0 top
U$79  105.84,41.07 0 top
U$80  111.09,41.07 0 top
U$81  116.7,41.07 0 top
U$82  121.59,41.07 0 top
U$83  126.84,41.07 0 top
U$84  95.34,35.83 0 top
U$85  100.59,35.83 0 top
U$86  105.84,35.83 0 top
U$87  111.09,35.83 0 top
U$88  116.7,35.83 0 top
U$89  121.59,35.83 0 top
U$90  126.84,35.83 0 top
U$91  132.09,35.83 0 top
U$92  95.34,30.57 0 top
U$93  100.59,30.57 0 top
U$94  105.84,30.57 0 top
U$95  111.09,30.57 0 top
U$96  116.7,30.57 0 top
U$97  121.59,30.57 0 top
U$98  126.84,30.57 0 top
U$99  132.09,30.57 0 top
U$100  95.34,25.32 0 top
U$101  100.59,25.32 0 top
U$102  105.84,25.32 0 top
U$103  111.09,25.32 0 top
U$104  116.7,25.32 0 top
U$105  121.59,25.32 0 top
U$106  126.84,25.32 0 top
U$107  132.09,25.32 0 top
U$108  95.34,20.07 0 top
U$109  100.59,20.07 0 top
U$110  105.84,20.07 0 top
U$111  111.09,20.07 0 top
U$112  116.7,20.07 0 top
U$113  121.59,20.07 0 top
U$114  126.84,20.07 0 top
U$115  132.09,20.07 0 top
U$116  100.59,14.82 0 top
U$117  105.84,14.82 0 top
U$118  111.09,14.82 0 top
U$119  116.7,14.82 0 top
U$120  121.59,14.82 0 top
U$121  126.84,14.82 0 top
U$122  105.84,9.57 0 top
U$123  111.09,9.57 0 top
U$124  116.7,9.57 0 top
U$125  121.59,9.57 0 top

### Tracks (layer width: path | path; a pad name or v marks a point on that pad's centre or on a via)
DIN
  Top 0.203: J1.3 50.54,28.13 R1.1
GND
  Top 0.203: J1.2 52.54,32.78 C2.-
  pour Top: 24.07,51.65 arc90 1.57,29.15 arc90 24.07,6.65 36.57,6.65 115.07,6.65 arc90 137.57,29.15 arc90 115.07,51.65 109.57,51.65
  pour Bottom: 24.07,51.65 arc90 1.57,29.15 arc90 24.07,6.65 31.57,6.65 115.07,6.65 arc90 137.57,29.15 arc90 115.07,51.65
N$1
  Top 0.203: U$3.DIN 23.8,48.25 25.64,48.25 U$2.DOUT
N$2
  Top 0.203: U$3.DOUT 18.39,48.17 17.97,47.75 17.17,46.94 U$4.DIN
N$3  (via drill 0.51)
  Top 0.203: R1.2 49.72,30.65 v48.57,30.65 | v36.57,46.65 33.14,46.65 U$1.DIN
  Bottom 0.203: v48.57,30.65 48.57,40.65 42.57,46.65 v36.57,46.65
N$4
  Top 0.203: U$2.DIN 29.05,48.25 30.89,48.25 U$1.DOUT
N$5  (via drill 0.51)
  Top 0.203: U$4.DOUT 14,48.17 v13.97,48.15 | v40.57,42.65 39.55,41.62 U$5.DIN
  Bottom 0.203: v13.97,48.15 13.97,45.25 14.57,44.65 38.57,44.65 v40.57,42.65
N$6
  Top 0.203: U$6.DIN 33.55,42.25 35.55,42.25 U$5.DOUT
N$7
  Top 0.203: U$7.DIN 28.3,42.25 30.3,42.25 U$6.DOUT
N$8
  Top 0.203: U$8.DIN 23.05,42.25 25.05,42.25 U$7.DOUT
N$9
  Top 0.203: U$9.DIN 17.79,42.25 19.79,42.25 U$8.DOUT
N$10
  Top 0.203: U$10.DIN 12.54,42.25 14.54,42.25 U$9.DOUT
N$11  (via drill 0.51)
  Top 0.203: U$10.DOUT 8.79,42.92 v8.77,42.95 | v45.57,39.15 45.57,38.52 U$11.DIN
  Bottom 0.203: v8.77,42.95 8.77,40.35 9.97,39.15 v45.57,39.15
N$12
  Top 0.203: U$12.DIN 38.84,37.05 40.84,37.05 U$11.DOUT
N$13
  Top 0.203: U$13.DIN 33.59,37.05 35.59,37.05 U$12.DOUT
N$14
  Top 0.203: U$14.DIN 28.34,37.05 30.34,37.05 U$13.DOUT
N$15
  Top 0.203: U$15.DIN 23.09,37.05 25.09,37.05 U$14.DOUT
N$16
  Top 0.203: U$16.DIN 17.84,37.05 19.84,37.05 U$15.DOUT
N$17
  Top 0.203: U$17.DIN 12.59,37.05 14.59,37.05 U$16.DOUT
N$18
  Top 0.203: U$18.DIN 7.34,37.05 9.34,37.05 U$17.DOUT
N$19  (via drill 0.51)
  Top 0.203: U$18.DOUT 3.57,36.52 v3.57,34.65 | U$19.DIN 46.05,31.12 46.57,31.65 v46.57,34.05
  Bottom 0.203: v3.57,34.65 4.17,34.05 v46.57,34.05
N$20
  Top 0.203: U$20.DIN 38.8,31.75 40.8,31.75 U$19.DOUT
N$21
  Top 0.203: U$21.DIN 33.55,31.75 35.55,31.75 U$20.DOUT
N$22
  Top 0.203: U$22.DIN 28.3,31.75 30.3,31.75 U$21.DOUT
N$23
  Top 0.203: U$23.DIN 23.05,31.75 25.05,31.75 U$22.DOUT
N$24
  Top 0.203: U$24.DIN 17.79,31.75 19.79,31.75 U$23.DOUT
N$25
  Top 0.203: U$25.DIN 12.54,31.75 14.54,31.75 U$24.DOUT
N$26
  Top 0.203: U$26.DIN 7.29,31.75 9.29,31.75 U$25.DOUT
N$27  (via drill 0.51)
  Top 0.203: U$26.DOUT 3.57,31.27 v3.57,29.65 | v44.57,26.36 44.08,25.88 U$27.DIN
  Bottom 0.203: v3.57,29.65 4.57,28.65 43.57,28.65 44.57,27.65 v44.57,26.36
N$28
  Top 0.203: U$28.DIN 38.84,26.55 40.84,26.55 U$27.DOUT
N$29
  Top 0.203: U$29.DIN 33.59,26.55 35.59,26.55 U$28.DOUT
N$30
  Top 0.203: U$30.DIN 28.34,26.55 30.34,26.55 U$29.DOUT
N$31
  Top 0.203: U$31.DIN 23.09,26.55 25.09,26.55 U$30.DOUT
N$32
  Top 0.203: U$32.DIN 17.84,26.55 19.84,26.55 U$31.DOUT
N$33
  Top 0.203: U$33.DIN 12.59,26.55 14.59,26.55 U$32.DOUT
N$34
  Top 0.203: U$34.DIN 7.34,26.55 9.34,26.55 U$33.DOUT
N$35  (via drill 0.51)
  Top 0.203: U$34.DOUT 3.57,26.02 v3.57,24.65 | v46.57,23.65 46.57,21.65 45.55,20.62 U$35.DIN
  Bottom 0.203: v3.57,24.65 4.57,23.65 v46.57,23.65
N$36
  Top 0.203: U$36.DIN 38.8,21.25 40.8,21.25 U$35.DOUT
N$37
  Top 0.203: U$37.DIN 33.55,21.25 35.55,21.25 U$36.DOUT
N$38
  Top 0.203: U$38.DIN 28.3,21.25 30.3,21.25 U$37.DOUT
N$39
  Top 0.203: U$39.DIN 23.05,21.25 25.05,21.25 U$38.DOUT
N$40
  Top 0.203: U$40.DIN 17.79,21.25 19.79,21.25 U$39.DOUT
N$41
  Top 0.203: U$41.DIN 12.54,21.25 14.54,21.25 U$40.DOUT
N$42
  Top 0.203: U$42.DIN 7.29,21.25 9.29,21.25 U$41.DOUT
N$43  (via drill 0.51)
  Top 0.203: U$42.DOUT 4.29,21.93 v3.57,22.65 | v41.47,15.45 41.4,15.38 U$43.DIN
  Bottom 0.203: v3.57,22.65 3.97,23.05 7.17,23.05 8.57,21.65 8.57,18.65 9.07,18.15 38.77,18.15 v41.47,15.45
N$44
  Top 0.203: U$44.DIN 33.49,15.95 35.49,15.95 U$43.DOUT
N$45
  Top 0.203: U$45.DIN 28.25,15.95 30.25,15.95 U$44.DOUT
N$46
  Top 0.203: U$46.DIN 23,15.95 25,15.95 U$45.DOUT
N$47
  Top 0.203: U$47.DIN 17.64,15.85 19.64,15.85 U$46.DOUT
N$48
  Top 0.203: U$48.DIN 12.49,15.95 14.5,15.95 U$47.DOUT
N$49  (via drill 0.51)
  Top 0.203: U$48.DOUT 9.95,16.65 v8.57,16.65 | v37.57,10.65 37.05,10.12 U$49.DIN
  Bottom 0.203: v8.57,16.65 8.57,14.65 10.17,13.05 35.17,13.05 v37.57,10.65
N$50
  Top 0.203: U$50.DIN 28.2,10.65 30.2,10.65 U$49.DOUT
N$51
  Top 0.203: U$51.DIN 22.95,10.65 24.95,10.65 U$50.DOUT
N$52
  Top 0.203: U$52.DIN 17.7,10.65 19.7,10.65 U$51.DOUT
N$53  (via drill 0.51)
  Top 0.203: U$52.DOUT 13.79,11.43 v13.57,11.65 | v48.57,43.65 49.05,44.12 U$66.DIN
  Bottom 0.203: v13.57,11.65 14.27,12.35 33.87,12.35 37.57,8.65 39.57,8.65 48.57,17.65 48.57,22.65 49.57,23.65 56.07,23.65 56.07,30.15 53.57,32.65 53.57,40.65 50.57,40.65 48.57,42.65 v48.57,43.65
N$54
  Top 0.203: U$60.DOUT 88.31,13.65 89.57,13.65 89.97,14.05 89.97,45.05 93.09,48.17 U$74.DIN
N$107
  Top 0.203: U$74.DOUT 109.19,46.88 110.49,48.17 U$75.DIN
N$108
  Top 0.203: U$75.DOUT 114.69,46.88 115.99,48.17 U$76.DIN
N$109
  Top 0.203: U$76.DOUT 119.89,46.88 121.19,48.17 U$77.DIN
N$110  (via drill 0.51)
  Top 0.203: U$77.DOUT 125.34,46.88 v125.57,46.65 | v98.57,44.65 100.29,42.92 U$78.DIN
  Bottom 0.203: v125.57,46.65 124.57,45.65 99.57,45.65 v98.57,44.65
N$111
  Top 0.203: U$78.DOUT 103.94,41.62 105.24,42.92 U$79.DIN
N$112
  Top 0.203: U$79.DOUT 109.14,41.62 110.44,42.92 U$80.DIN
N$113
  Top 0.203: U$80.DOUT 114.44,41.62 115.74,42.92 U$81.DIN
N$114
  Top 0.203: U$81.DOUT 119.74,41.62 121.04,42.92 U$82.DIN
N$115
  Top 0.203: U$82.DOUT 124.94,41.62 126.24,42.92 U$83.DIN
N$116  (via drill 0.51)
  Top 0.203: U$83.DOUT 129.69,41.62 v130.37,40.95 | v93.57,38.65 94.54,37.67 U$84.DIN
  Bottom 0.203: v130.37,40.95 129.07,39.65 94.57,39.65 v93.57,38.65
N$117
  Top 0.203: U$66.DOUT 53.84,42.82 55.15,44.12 U$67.DIN
N$118
  Top 0.203: U$67.DOUT 58.95,42.82 60.24,44.12 U$68.DIN
N$119
  Top 0.203: U$68.DOUT 63.95,42.82 65.24,44.12 U$69.DIN
N$120
  Top 0.203: U$69.DOUT 69.04,42.82 70.34,44.12 U$70.DIN
N$121
  Top 0.203: U$70.DOUT 73.84,42.82 75.14,44.12 U$71.DIN
N$122
  Top 0.203: U$71.DOUT 79.04,42.82 80.34,44.12 U$72.DIN
N$123
  Top 0.203: U$72.DOUT 84.04,42.82 85.34,44.12 U$73.DIN
N$124
  Top 0.203: U$84.DOUT 98.69,36.38 99.99,37.67 U$85.DIN
N$125
  Top 0.203: U$85.DOUT 103.79,36.38 105.09,37.67 U$86.DIN
N$126
  Top 0.203: U$86.DOUT 108.99,36.38 110.29,37.67 U$87.DIN
N$127
  Top 0.203: U$87.DOUT 114.19,36.38 115.49,37.67 U$88.DIN
N$128
  Top 0.203: U$88.DOUT 119.69,36.38 120.99,37.67 U$89.DIN
N$129
  Top 0.203: U$89.DOUT 124.59,36.38 125.89,37.67 U$90.DIN
N$130  (via drill 0.51)
  Top 0.203: U$91.DOUT 135.57,35.23 v135.57,34.65 | v93.57,32.65 95.49,32.65 U$92.DIN
  Bottom 0.203: v135.57,34.65 134.37,33.45 94.37,33.45 v93.57,32.65
N$131
  Top 0.203: U$92.DOUT 98.54,31.12 99.84,32.42 U$93.DIN
N$132
  Top 0.203: U$93.DOUT 103.74,31.12 105.04,32.42 U$94.DIN
N$133
  Top 0.203: U$94.DOUT 109.04,31.12 110.34,32.42 U$95.DIN
N$134
  Top 0.203: U$95.DOUT 114.34,31.12 115.64,32.42 U$96.DIN
N$135
  Top 0.203: U$73.DOUT 88.17,36.85 U$61.DIN
N$136
  Top 0.203: U$61.DOUT 77.24,30.02 75.94,28.72 U$62.DIN
N$137
  Top 0.203: U$96.DOUT 119.64,31.12 120.94,32.42 U$97.DIN
N$138
  Top 0.203: U$62.DOUT 72.64,30.02 71.34,28.72 U$63.DIN
N$139
  Top 0.203: U$63.DOUT 67.94,30.02 66.64,28.72 U$64.DIN
N$140
  Top 0.203: U$64.DOUT 63.15,30.02 61.84,28.72 U$65.DIN
N$141
  Top 0.203: U$65.DOUT 56.57,27.42 56.57,20.6 U$53.DIN
N$142
  Top 0.203: U$53.DOUT 53.74,13.52 55.04,14.82 U$54.DIN
N$143
  Top 0.203: U$54.DOUT 58.94,13.52 60.24,14.82 U$55.DIN
N$144
  Top 0.203: U$55.DOUT 63.84,13.52 65.14,14.82 U$56.DIN
N$145
  Top 0.203: U$56.DOUT 68.74,13.52 70.04,14.82 U$57.DIN
N$146
  Top 0.203: U$57.DOUT 73.84,13.52 75.14,14.82 U$58.DIN
N$147
  Top 0.203: U$58.DOUT 78.94,13.52 80.24,14.82 U$59.DIN
N$148
  Top 0.203: U$59.DOUT 84.24,13.52 85.54,14.82 U$60.DIN
N$149
  Top 0.203: U$97.DOUT 124.74,31.12 126.04,32.42 U$98.DIN
N$150
  Top 0.203: U$98.DOUT 130.15,31.12 131.44,32.42 U$99.DIN
N$151  (via drill 0.51)
  Top 0.203: U$99.DOUT 135.5,30.05 v135.57,30.05 | v93.57,27.65 94.04,27.17 U$100.DIN
  Bottom 0.203: v135.57,30.05 133.77,28.25 94.17,28.25 v93.57,27.65
N$152
  Top 0.203: U$100.DOUT 98.69,25.88 99.99,27.17 U$101.DIN
N$153
  Top 0.203: U$101.DOUT 103.79,25.88 105.09,27.17 U$102.DIN
N$154
  Top 0.203: U$102.DOUT 108.99,25.88 110.29,27.17 U$103.DIN
N$155
  Top 0.203: U$103.DOUT 114.39,25.88 115.69,27.17 U$104.DIN
N$156
  Top 0.203: U$104.DOUT 119.79,25.88 121.09,27.17 U$105.DIN
N$157
  Top 0.203: U$105.DOUT 124.89,25.88 126.19,27.17 U$106.DIN
N$158
  Top 0.203: U$106.DOUT 130.09,25.88 131.4,27.17 U$107.DIN
N$159  (via drill 0.51)
  Top 0.203: U$107.DOUT 135.44,24.85 v135.57,24.85 | v93.57,22.65 94.29,21.93 U$108.DIN
  Bottom 0.203: v135.57,24.85 133.67,22.95 93.87,22.95 v93.57,22.65
N$160
  Top 0.203: U$108.DOUT 98.64,20.62 99.94,21.93 U$109.DIN
N$161
  Top 0.203: U$109.DOUT 103.74,20.62 105.04,21.93 U$110.DIN
N$162
  Top 0.203: U$110.DOUT 109.04,20.62 110.34,21.93 U$111.DIN
N$163
  Top 0.203: U$111.DOUT 114.54,20.62 115.84,21.93 U$112.DIN
N$164
  Top 0.203: U$112.DOUT 119.64,20.62 120.94,21.93 U$113.DIN
N$165
  Top 0.203: U$113.DOUT 124.84,20.62 126.14,21.93 U$114.DIN
N$166
  Top 0.203: U$114.DOUT 130.34,20.62 131.65,21.93 U$115.DIN
N$167  (via drill 0.51)
  Top 0.203: v133.37,19.05 134.27,19.95 134.27,20.47 U$115.DOUT | v97.57,17.65 98.54,16.68 U$116.DIN
  Bottom 0.203: v133.37,19.05 98.97,19.05 v97.57,17.65
N$168
  Top 0.203: U$116.DOUT 103.99,15.38 105.29,16.68 U$117.DIN
N$169
  Top 0.203: U$117.DOUT 109.19,15.38 110.49,16.68 U$118.DIN
N$170
  Top 0.203: U$118.DOUT 114.39,15.38 115.69,16.68 U$119.DIN
N$171
  Top 0.203: U$119.DOUT 119.79,15.38 121.09,16.68 U$120.DIN
N$172
  Top 0.203: U$120.DOUT 124.89,15.38 126.19,16.68 U$121.DIN
N$173  (via drill 0.51)
  Top 0.203: U$121.DOUT 129.17,13.85 v128.57,13.25 | v102.17,12.15 102.89,11.43 U$122.DIN
  Bottom 0.203: v128.57,13.25 127.47,12.15 v102.17,12.15
N$174
  Top 0.203: U$122.DOUT 109.24,10.12 110.54,11.43 U$123.DIN
N$175
  Top 0.203: U$123.DOUT 114.54,10.12 115.84,11.43 U$124.DIN
N$176
  Top 0.203: U$124.DOUT 119.74,10.12 121.04,11.43 U$125.DIN
N$177
  Top 0.203: U$90.DOUT 129.79,36.38 131.09,37.67 U$91.DIN
VCC  (via drill 0.51)
  Top 0.203: 33.89,49.15 28.57,49.15 | 28.57,49.15 23.39,49.15 | 23.39,49.15 18.14,49.15 U$4.VCC 16.19,47.2 C7.2 | 39.57,48.65 34.97,48.65 34.47,49.15 33.89,49.15 | 23.39,49.15 U$3.VCC 21.59,47.34 C6.2 | 28.57,49.15 28.57,49.07 U$2.VCC 26.69,47.2 C5.2 | 33.89,49.15 U$1.VCC 31.99,47.24 C4.2 | 39.57,48.65 38.97,48.05 38.97,45.65 37.47,44.15 36.95,44.15 | 18.39,44.15 U$9.VCC 16.09,41.84 C11.1 | 36.95,44.15 34.14,44.15 | 34.14,44.15 28.89,44.15 | 28.89,44.15 23.57,44.15 | 23.57,44.15 18.39,44.15 | 23.57,44.15 22.42,43 U$8.VCC 21.39,41.89 C10.1 | 28.89,44.15 U$7.VCC 26.59,41.84 C9.1 | 34.14,44.15 U$6.VCC 31.89,41.89 C8.1 | U$5.VCC 38.01,43.09 | 38.01,43.09 36.95,44.15 | 18.39,44.15 13.14,44.15 U$10.VCC 10.89,41.89 C12.1 | 42.57,38.65 42.57,40.65 45.62,43.7 46.62,43.7 | 42.57,38.65 42.57,38.52 U$11.VCC 42.29,36.55 C14.1 | 42.57,38.65 39.15,38.65 | 39.15,38.65 33.89,38.65 | 33.89,38.65 28.57,38.65 | 28.57,38.65 23.39,38.65 | 23.39,38.65 18.14,38.65 | 18.14,38.65 12.89,38.65 | 12.89,38.65 7.57,38.65 6.67,37.75 U$18.VCC 5.59,36.59 C21.1 | 12.89,38.65 U$17.VCC 10.89,36.65 C20.1 | 18.14,38.65 U$16.VCC 16.09,36.59 C19.1 | 23.39,38.65 U$15.VCC 21.39,36.65 C18.1 | 28.57,38.65 28.57,38.58 U$14.VCC 26.59,36.59 C17.1 | 33.89,38.65 U$13.VCC 31.79,36.55 C16.1 | 39.15,38.65 U$12.VCC 37.09,36.59 C15.1 | 43.42,32.5 U$19.VCC | 44.37,33.45 46.57,35.65 46.57,37.65 46.62,37.7 52.62,37.7 | 44.37,33.45 43.42,32.5 | 39.2,33.45 U$20.VCC 37.09,31.34 C25.1 | 39.2,33.45 44.37,33.45 | 39.2,33.45 33.95,33.45 | 33.95,33.45 U$21.VCC 31.79,31.29 C26.1 | 33.95,33.45 28.7,33.45 | 28.7,33.45 U$22.VCC 26.59,31.34 C27.1 | 28.7,33.45 23.45,33.45 | 23.45,33.45 U$23.VCC 21.29,31.29 C28.1
  Top 0.203: 23.45,33.45 18.2,33.45 | 18.2,33.45 U$24.VCC 16.09,31.34 C29.1 | 18.2,33.45 12.95,33.45 | 12.95,33.45 U$25.VCC 10.79,31.29 C23.1 | 12.95,33.45 7.69,33.45 U$26.VCC 5.59,31.34 C22.1 | v45.57,27.65 45.09,27.17 U$27.VCC 42.29,26.04 C32.1 | v45.57,32.65 45.17,32.65 44.37,33.45 | v45.57,27.65 45.57,24.65 | 45.57,24.65 45.57,24.07 44.15,22.65 | 44.15,22.65 U$35.VCC 42.29,20.79 C40.1 | 38.9,22.65 U$36.VCC 37.09,20.84 C41.1 | 44.15,22.65 38.9,22.65 | 33.64,22.65 U$37.VCC 31.79,20.79 C42.1 | 33.64,22.65 38.9,22.65 | 33.64,22.65 28.39,22.65 | 28.39,22.65 U$38.VCC 26.59,20.84 C43.1 | 23.14,22.65 U$39.VCC 21.29,20.79 C44.1 | 28.39,22.65 23.14,22.65 | 17.89,22.65 U$40.VCC 16.02,20.78 16.02,20.2 15.99,20.16 C45.1 | 23.14,22.65 17.89,22.65 | 17.89,22.65 12.64,22.65 | 12.64,22.65 7.39,22.65 U$42.VCC 5.59,20.84 C38.1 | 45.57,24.65 47.57,24.65 47.57,17.65 46.57,16.65 v45.57,16.65 38.2,16.65 U$43.VCC | U$43.VCC 37.2,17.65 33.89,17.65 | 33.89,17.65 U$44.VCC 32.05,15.8 C48.1 | 33.89,17.65 28.64,17.65 | 28.64,17.65 U$45.VCC 26.69,15.7 C49.1 | 28.64,17.65 23.39,17.65 | 23.39,17.65 U$46.VCC 21.3,15.55 C50.1 | 23.39,17.65 18.14,17.65 | 18.14,17.65 U$47.VCC 16.19,15.7 C51.1 | 18.14,17.65 12.89,17.65 U$48.VCC 10.79,15.54 C46.1 | 34.14,12.65 U$49.VCC 31.89,10.39 C52.1 | 28.89,12.65 U$50.VCC 26.59,10.34 C53.1 | 28.89,12.65 34.14,12.65 | 23.64,12.65 U$51.VCC 21.39,10.39 C54.1 | 28.89,12.65 23.64,12.65 | 23.64,12.65 18.39,12.65 U$52.VCC 16.17,10.42 16.17,9.89 17.41,8.65 C55.1 | J1.1 54.54,32.52 C2.+ | C2.+ 53.62,36.7 | 53.62,36.7 52.62,37.7 | 52.62,37.7 47.62,42.7 | 47.62,42.7 46.62,43.7 | 46.62,43.7 41.67,48.65 39.57,48.65 | 47.62,42.7 50.67,42.7 U$66.VCC 50.79,42.89 51.6,43.7 51.6,46.26 C1.1
  Top 0.203: 53.62,36.7 56.13,39.21 56.13,39.65 | 56.13,39.65 U$67.VCC 57.07,43.77 57.07,46.13 C56.1 | 56.13,39.65 58.57,39.65 | 58.57,39.65 59.57,40.65 59.57,42.65 59.74,42.82 U$68.VCC 62.17,43.79 62.17,46.07 C57.1 | 58.57,39.65 63.57,39.65 | 63.57,39.65 64.57,40.65 64.57,42.65 64.74,42.82 U$69.VCC 66.97,43.76 66.97,46.33 C58.1 | 63.57,39.65 68.57,39.65 | 68.57,39.65 69.57,40.65 69.57,42.65 69.74,42.82 U$70.VCC 72.17,43.88 72.17,45.72 72.12,45.77 72.12,45.92 C59.1 | 68.57,39.65 73.57,39.65 | 73.57,39.65 74.57,40.65 74.57,42.65 74.74,42.82 U$71.VCC 76.87,43.76 76.87,46.17 C60.1 | 73.57,39.65 78.57,39.65 | 78.57,39.65 79.57,40.65 79.57,42.65 79.74,42.82 U$72.VCC 82.19,43.74 C61.1 | 78.57,39.65 83.57,39.65 84.57,40.65 84.57,42.65 84.74,42.82 U$73.VCC 87.09,43.69 C62.1 | C65.1 61.12,30.68 U$65.VCC 61.67,30.57 61.67,34.05 61.57,34.15 | C64.1 64.15,31.57 U$64.VCC 66.57,30.9 66.57,34.15 | C63.1 69.15,31.4 U$63.VCC 71.57,31.07 71.57,34.15 | C66.1 75.35,30.45 U$62.VCC 76.57,31.25 76.57,34.15 | C67.1 80.05,30.75 U$61.VCC 80.57,30.55 80.57,33.65 80.07,34.15 76.57,34.15 | C75.1 86.22,12.41 U$60.VCC 85.94,13.52 85.07,12.65 85.07,11.15 84.07,10.15 79.57,10.15 | C74.1 81.27,12.37 U$59.VCC 79.57,11.82 79.57,10.15 | C73.1 75.94,12.7 U$58.VCC 74.57,12.15 74.57,10.15 | C72.1 71.11,12.53 U$57.VCC 69.57,11.98 69.57,10.15 | C71.1 66.03,12.61 U$56.VCC 64.57,12.06 64.57,10.15 | C70.1 61.21,12.43 U$55.VCC 59.57,11.88 59.57,10.15 | C69.1 56.13,12.51 U$54.VCC 55.57,12.96 55.57,10.15 | C68.1 50.79,12.85 U$53.VCC 49.57,12.3 v49.57,11.65 51.07,10.15 55.57,10.15 | C2.+ 61.57,34.15 | 61.57,34.15 66.57,34.15
  Top 0.203: 66.57,34.15 71.57,34.15 | 71.57,34.15 76.57,34.15 | 55.57,10.15 59.57,10.15 | 59.57,10.15 64.57,10.15 | 64.57,10.15 69.57,10.15 | 69.57,10.15 74.57,10.15 | 74.57,10.15 79.57,10.15 | v91.57,35.65 91.57,40.65 | 91.57,40.65 91.57,43.65 93.97,46.05 105.39,46.05 | C79.1 102.07,44.33 102.07,42.73 U$78.VCC 99.99,40.65 | C90.1 123.07,38.97 123.07,37.48 U$89.VCC 121.24,35.65 | 105.39,46.05 110.64,46.05 | 110.64,46.05 116.25,46.05 | 116.25,46.05 121.14,46.05 U$77.VCC 123.07,47.98 123.07,48.31 121.73,49.65 C78.1 | 116.25,46.05 U$76.VCC 117.07,46.94 117.88,47.75 117.88,48.6 117.87,48.61 117.87,48.75 117.07,49.55 C77.1 | 110.64,46.05 U$75.VCC 112.55,47.95 C76.1 | 105.39,46.05 U$74.VCC 107.35,48 C3.1 | 91.57,40.65 99.99,40.65 | 99.99,40.65 105.24,40.65 | 105.24,40.65 110.49,40.65 | 110.49,40.65 116.1,40.65 | 116.1,40.65 120.99,40.65 | 120.99,40.65 126.57,40.65 127.22,41.3 U$83.VCC 128.35,42.75 C84.1 | 120.99,40.65 U$82.VCC 121.97,41.69 122.77,42.5 122.77,44.07 C83.1 | 116.1,40.65 U$81.VCC 117.07,41.69 117.88,42.5 117.88,43.98 C82.1 | 110.49,40.65 U$80.VCC 112.55,42.7 C81.1 | 105.24,40.65 U$79.VCC 107.25,42.66 C80.1 | v91.57,35.65 94.99,35.65 | 94.99,35.65 100.24,35.65 | 100.24,35.65 105.49,35.65 | 105.49,35.65 110.74,35.65 | 110.74,35.65 116.35,35.65 | 116.35,35.65 121.24,35.65 | 121.24,35.65 126.49,35.65 | 126.49,35.65 131.75,35.65 U$91.VCC 133.55,37.45 C92.1 | 126.49,35.65 U$90.VCC 128.25,37.41 C91.1 | 116.35,35.65 U$88.VCC 118.15,37.45 C89.1 | 110.74,35.65 U$87.VCC 112.55,37.45 C88.1 | 105.49,35.65 U$86.VCC 107.35,37.51 C87.1 | 100.24,35.65 U$85.VCC 102.05,37.45 C86.1 | 94.99,35.65 U$84.VCC 96.75,37.41 C85.1
  Top 0.203: v91.57,35.65 91.57,30.65 | 91.57,30.65 92.07,30.15 94.74,30.15 | 94.74,30.15 99.99,30.15 | 99.99,30.15 105.24,30.15 | 105.24,30.15 110.49,30.15 | 110.49,30.15 116.1,30.15 | 116.1,30.15 120.99,30.15 | 120.99,30.15 126.24,30.15 | 126.24,30.15 131.5,30.15 U$99.VCC 132.47,31.19 133.28,32 133.28,33.58 C100.1 | 126.24,30.15 U$98.VCC 127.22,31.19 128.03,32 128.03,33.52 C99.1 | 120.99,30.15 U$97.VCC 123.05,32.2 C98.1 | 116.1,30.15 U$96.VCC 118.15,32.2 C97.1 | 110.49,30.15 U$95.VCC 111.47,31.19 112.27,32 112.27,33.67 C96.1 | 105.24,30.15 U$94.VCC 106.22,31.19 107.02,32 107.02,33.52 C95.1 | 99.99,30.15 U$93.VCC 100.97,31.19 101.77,32 101.77,33.58 C94.1 | 94.74,30.15 U$92.VCC 95.72,31.19 96.52,32 96.52,33.52 C93.1 | 91.57,30.65 91.57,25.65 | 91.57,25.65 92.27,24.95 94.79,24.95 | 94.79,24.95 100.04,24.95 | 100.04,24.95 105.29,24.95 | 105.29,24.95 110.54,24.95 | 110.54,24.95 116.15,24.95 | 116.15,24.95 121.04,24.95 | 121.04,24.95 126.29,24.95 | 126.29,24.95 131.54,24.95 U$107.VCC 133.55,26.95 C108.1 | 126.29,24.95 U$106.VCC 128.25,26.9 C107.1 | 121.04,24.95 U$105.VCC 121.97,25.94 122.77,26.75 122.77,28.47 C106.1 | 116.15,24.95 U$104.VCC 117.07,25.94 117.88,26.75 117.88,28.48 C105.1 | 110.54,24.95 U$103.VCC 111.47,25.94 112.27,26.75 112.27,28.47 C104.1 | 105.29,24.95 U$102.VCC 106.22,25.94 107.02,26.75 107.02,28.42 C103.1 | 100.04,24.95 U$101.VCC 100.97,25.94 101.77,26.75 101.77,28.47 C102.1 | 94.79,24.95 U$100.VCC 96.65,26.8 C101.1 | 91.57,25.65 91.57,20.65 92.57,19.65 | 92.57,19.65 94.57,19.65 | 94.57,19.65 99.99,19.65 | 99.99,19.65 105.24,19.65 | 105.24,19.65 110.49,19.65 | 110.49,19.65 116.1,19.65
  Top 0.203: 116.1,19.65 120.99,19.65 | 120.99,19.65 126.24,19.65 | 126.24,19.65 131.5,19.65 U$115.VCC 133.55,21.7 C116.1 | 126.24,19.65 U$114.VCC 128.25,21.66 C115.1 | 120.99,19.65 U$113.VCC 123.05,21.7 C114.1 | 116.1,19.65 U$112.VCC 118.15,21.7 C113.1 | 110.49,19.65 U$111.VCC 112.45,21.61 C112.1 | 105.24,19.65 U$110.VCC 107.25,21.66 C111.1 | 99.99,19.65 U$109.VCC 102.05,21.7 C110.1 | 94.57,19.65 95.54,20.62 U$108.VCC 96.85,21.75 C109.1 | 92.57,19.65 97.87,14.35 | 99.94,14.35 97.87,14.35 | 99.94,14.35 105.19,14.35 | 105.19,14.35 110.44,14.35 | 110.44,14.35 116.05,14.35 | 116.05,14.35 120.94,14.35 | 120.94,14.35 126.19,14.35 U$121.VCC 128.35,16.5 C122.1 | 120.94,14.35 U$120.VCC 123.05,16.45 C121.1 | 116.05,14.35 U$119.VCC 118.05,16.35 C120.1 | 110.44,14.35 U$118.VCC 112.55,16.45 C119.1 | 105.19,14.35 U$117.VCC 107.25,16.41 C118.1 | 99.94,14.35 U$116.VCC 102.05,16.45 C117.1 | 97.87,14.35 102.97,9.25 105.34,9.25 | 105.34,9.25 110.59,9.25 | 110.59,9.25 116.2,9.25 | 116.2,9.25 121.09,9.25 U$125.VCC 123.05,11.2 C126.1 | 116.2,9.25 U$124.VCC 118.15,11.2 C125.1 | 110.59,9.25 U$123.VCC 112.55,11.2 C124.1 | 105.34,9.25 U$122.VCC 106.22,10.19 107.02,11 107.02,12.72 C123.1 | C13.1 37.19,42.27 38.01,43.09 | C24.1 42.29,31.37 43.42,32.5 | C33.1 37.09,26.09 U$28.VCC 39.15,28.15 | C34.1 31.79,26.04 U$29.VCC 33.89,28.15 | C35.1 26.59,26.09 U$30.VCC 28.64,28.15 | C36.1 21.29,26.04 U$31.VCC 23.39,28.15 | C37.1 16.09,26.09 U$32.VCC 18.14,28.15 | C31.1 10.79,26.04 U$33.VCC 12.89,28.15 | C30.1 5.59,26.09 U$34.VCC 7.64,28.15 12.89,28.15 | C39.1 10.89,20.89 U$41.VCC 12.64,22.65 | v45.57,27.65 45.07,28.15 39.15,28.15 | 39.15,28.15 33.89,28.15
  Top 0.203: 33.89,28.15 28.64,28.15 | 28.64,28.15 23.39,28.15 | 23.39,28.15 18.14,28.15 | 18.14,28.15 12.89,28.15 | 34.14,12.65 v38.57,12.65 | C47.1 37.15,15.66 U$43.VCC
  Bottom 0.203: v45.57,27.65 v45.57,32.65 | v49.57,11.65 49.57,18.65 50.57,19.65 56.57,19.65 57.57,20.65 57.57,32.75 C2.+ 57.67,35.65 v91.57,35.65 | v38.57,12.65 42.57,12.65 45.57,15.65 v45.57,16.65